# EAGLE design Display_Board_v3 (EAGLE 9.0.0)

## Sheet 1 of 3: Micro and CAN
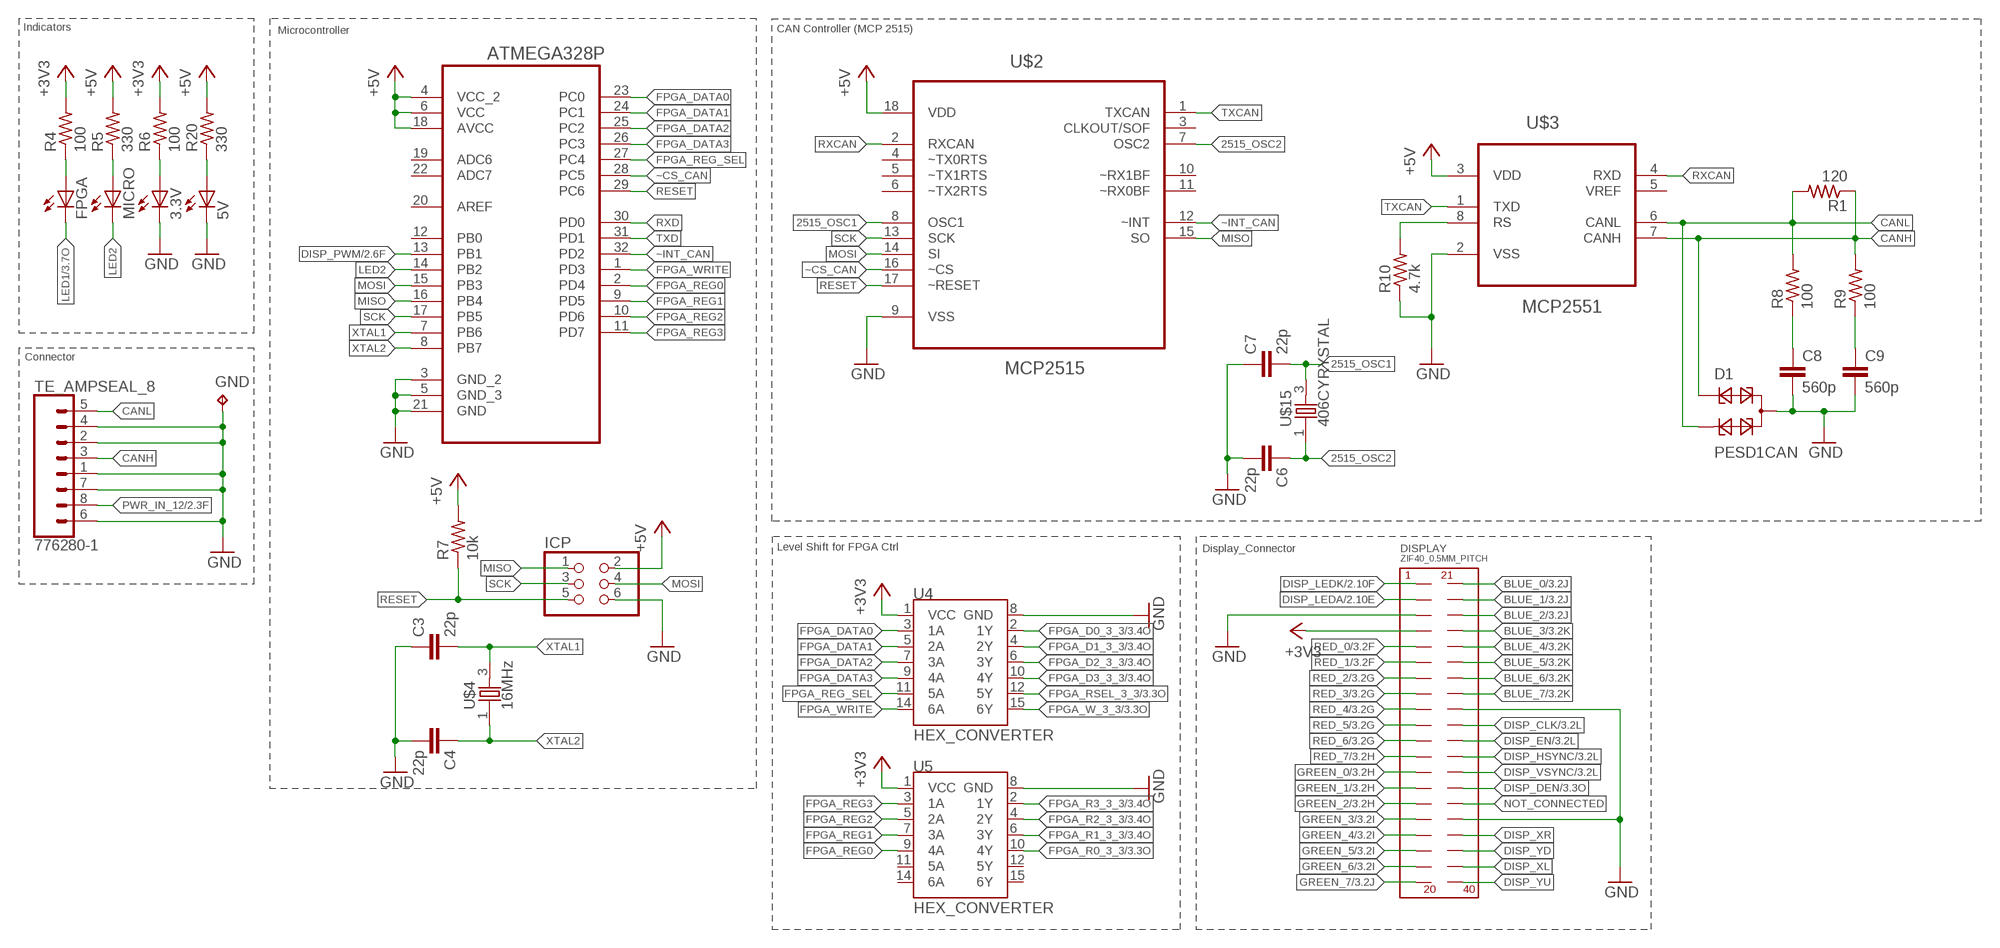
[diagram p0: schematic, sheet 1]

### Parts
3.3V  LEDCHIP-LED0805  [CHIP-LED0805]
5V  LEDCHIP-LED0805  [CHIP-LED0805]
ATMEGA328P  ATMEGA328P-AU  [QFP80P900X900X120-32N]
C3  22p  C-EUC0805K  [C0805K]
C4  22p  C-EUC0805K  [C0805K]
C6  22p  C-EUC0805K  [C0805K]
C7  22p  C-EUC0805K  [C0805K]
C8  560p  C-EUC0805K  [C0805K]
C9  560p  C-EUC0805K  [C0805K]
D1  PESD1CAN  [SOT23]
DISPLAY  ZIF40_0.5MM_PITCH  [ZIF40]
FPGA  LEDCHIP-LED0805  [CHIP-LED0805]
GND  TPTP12SQ  [TP12SQ]
ICP  PINHD-2X3  [2X03]
MICRO  LEDCHIP-LED0805  [CHIP-LED0805]
R1  120  R-US_R0805  [R0805]
R4  100  R-US_R0805  [R0805]
R5  330  R-US_R0805  [R0805]
R6  100  R-US_R0805  [R0805]
R7  10k  R-US_R0805  [R0805]
R8  100  R-US_R0805  [R0805]
R9  100  R-US_R0805  [R0805]
R10  4.7k  R-US_R0805  [R0805]
R20  330  R-US_R0805  [R0805]
TE_AMPSEAL_8  776280-1  [776280-1]
U4  HEX_CONVERTER  [SO016]
U5  HEX_CONVERTER  [SO016]
U$2  MCP2515  MCP2515-I/SO  [SOIC127P1034X264-18N]
U$3  MCP2551  MCP2551-I/SN  [SOIC127P600X175-8N]
U$4  16MHz  406CYRYSTAL  [CTS406]
U$15  406CYRYSTAL  [CTS406]

### Nets
2515_OSC1: C7.2 U$2.8(OSC1) U$15.3
2515_OSC2: C6.1 U$2.7(OSC2) U$15.1
+3V3: DISPLAY.P$4 R4.2 R6.2 U4.1(VCC) U5.1(VCC) ; also sheet 2,3
+5V: ATMEGA328P.4(VCC_2) ATMEGA328P.6(VCC) ATMEGA328P.18(AVCC) ICP.2 R5.2 R7.2 R20.2 U$2.18(VDD) U$3.3(VDD) ; also sheet 2
BLUE_0: DISPLAY.P$21 ; also sheet 3
BLUE_1: DISPLAY.P$22 ; also sheet 3
BLUE_2: DISPLAY.P$23 ; also sheet 3
BLUE_3: DISPLAY.P$24 ; also sheet 3
BLUE_4: DISPLAY.P$25 ; also sheet 3
BLUE_5: DISPLAY.P$26 ; also sheet 3
BLUE_6: DISPLAY.P$27 ; also sheet 3
BLUE_7: DISPLAY.P$28 ; also sheet 3
CANH: D1.1 R1.1 R9.2 TE_AMPSEAL_8.3 U$3.7(CANH)
CANL: D1.2 R1.2 R8.2 TE_AMPSEAL_8.5 U$3.6(CANL)
DISP_CLK: DISPLAY.P$30 ; also sheet 3
DISP_DEN: DISPLAY.P$34 ; also sheet 3
DISP_EN: DISPLAY.P$31 ; also sheet 3
DISP_HSYNC: DISPLAY.P$32 ; also sheet 3
DISP_LEDA: DISPLAY.P$2 ; also sheet 2
DISP_LEDK: DISPLAY.P$1 ; also sheet 2
DISP_PWM: ATMEGA328P.13(PB1) ; also sheet 2
DISP_VSYNC: DISPLAY.P$33 ; also sheet 3
DISP_XL: DISPLAY.P$39
DISP_XR: DISPLAY.P$37
DISP_YD: DISPLAY.P$38
DISP_YU: DISPLAY.P$40
FPGA_D0_3_3: U4.2(1Y) ; also sheet 3
FPGA_D1_3_3: U4.4(2Y) ; also sheet 3
FPGA_D2_3_3: U4.6(3Y) ; also sheet 3
FPGA_D3_3_3: U4.10(4Y) ; also sheet 3
FPGA_DATA0: ATMEGA328P.23(PC0) U4.3(1A)
FPGA_DATA1: ATMEGA328P.24(PC1) U4.5(2A)
FPGA_DATA2: ATMEGA328P.25(PC2) U4.7(3A)
FPGA_DATA3: ATMEGA328P.26(PC3) U4.9(4A)
FPGA_R0_3_3: U5.10(4Y) ; also sheet 3
FPGA_R1_3_3: U5.6(3Y) ; also sheet 3
FPGA_R2_3_3: U5.4(2Y) ; also sheet 3
FPGA_R3_3_3: U5.2(1Y) ; also sheet 3
FPGA_REG0: ATMEGA328P.2(PD4) U5.9(4A)
FPGA_REG1: ATMEGA328P.9(PD5) U5.7(3A)
FPGA_REG2: ATMEGA328P.10(PD6) U5.5(2A)
FPGA_REG3: ATMEGA328P.11(PD7) U5.3(1A)
FPGA_REG_SEL: ATMEGA328P.27(PC4) U4.11(5A)
FPGA_RSEL_3_3: U4.12(5Y) ; also sheet 3
FPGA_W_3_3: U4.15(6Y) ; also sheet 3
FPGA_WRITE: ATMEGA328P.1(PD3) U4.14(6A)
GND: 3.3V.C 5V.C ATMEGA328P.3(GND_2) ATMEGA328P.5(GND_3) ATMEGA328P.21(GND) C3.1 C4.2 C6.2 C7.1 C8.2 C9.2 D1.3 DISPLAY.P$3 DISPLAY.P$29 DISPLAY.P$36 GND.TP ICP.6 R10.1 TE_AMPSEAL_8.1 TE_AMPSEAL_8.2 TE_AMPSEAL_8.4 TE_AMPSEAL_8.6 TE_AMPSEAL_8.7 U4.8(GND) U5.8(GND) U$2.9(VSS) U$3.2(VSS) ; also sheet 2,3
GREEN_0: DISPLAY.P$13 ; also sheet 3
GREEN_1: DISPLAY.P$14 ; also sheet 3
GREEN_2: DISPLAY.P$15 ; also sheet 3
GREEN_3: DISPLAY.P$16 ; also sheet 3
GREEN_4: DISPLAY.P$17 ; also sheet 3
GREEN_5: DISPLAY.P$18 ; also sheet 3
GREEN_6: DISPLAY.P$19 ; also sheet 3
GREEN_7: DISPLAY.P$20 ; also sheet 3
LED1: FPGA.C ; also sheet 3
LED2: ATMEGA328P.14(PB2) MICRO.C
MISO: ATMEGA328P.16(PB4) ICP.1 U$2.15(SO)
MOSI: ATMEGA328P.15(PB3) ICP.4 U$2.14(SI)
N$2: FPGA.A R4.1
N$3: MICRO.A R5.1
N$4: 3.3V.A R6.1
N$5: R10.2 U$3.8(RS)
N$6: C8.1 R8.1
N$7: C9.1 R9.1
N$12: 5V.A R20.1
NOT_CONNECTED: DISPLAY.P$35
PWR_IN_12: TE_AMPSEAL_8.8 ; also sheet 2
RED_0: DISPLAY.P$5 ; also sheet 3
RED_1: DISPLAY.P$6 ; also sheet 3
RED_2: DISPLAY.P$7 ; also sheet 3
RED_3: DISPLAY.P$8 ; also sheet 3
RED_4: DISPLAY.P$9 ; also sheet 3
RED_5: DISPLAY.P$10 ; also sheet 3
RED_6: DISPLAY.P$11 ; also sheet 3
RED_7: DISPLAY.P$12 ; also sheet 3
RESET: ATMEGA328P.29(PC6) ICP.5 R7.1 U$2.17(~RESET)
RXCAN: U$2.2(RXCAN) U$3.4(RXD)
RXD: ATMEGA328P.30(PD0)
SCK: ATMEGA328P.17(PB5) ICP.3 U$2.13(SCK)
TXCAN: U$2.1(TXCAN) U$3.1(TXD)
TXD: ATMEGA328P.31(PD1)
XTAL1: ATMEGA328P.7(PB6) C3.2 U$4.3
XTAL2: ATMEGA328P.8(PB7) C4.1 U$4.1
~CS_CAN: ATMEGA328P.28(PC5) U$2.16(~CS)
~INT_CAN: ATMEGA328P.32(PD2) U$2.12(~INT)
Unconnected: ATMEGA328P.12(PB0) ATMEGA328P.19(ADC6) ATMEGA328P.20(AREF) ATMEGA328P.22(ADC7) U5.11(5A) U5.12(5Y) U5.14(6A) U5.15(6Y) U$2.3(CLKOUT/SOF) U$2.4(~TX0RTS) U$2.5(~TX1RTS) U$2.6(~TX2RTS) U$2.10(~RX1BF) U$2.11(~RX0BF) U$3.5(VREF)

### Notes on the sheet
- Indicators | Microcontroller | CAN Controller (MCP 2515)
- Connector
- Level Shift for FPGA Ctrl | Display_Connector

## Sheet 2 of 3: Power
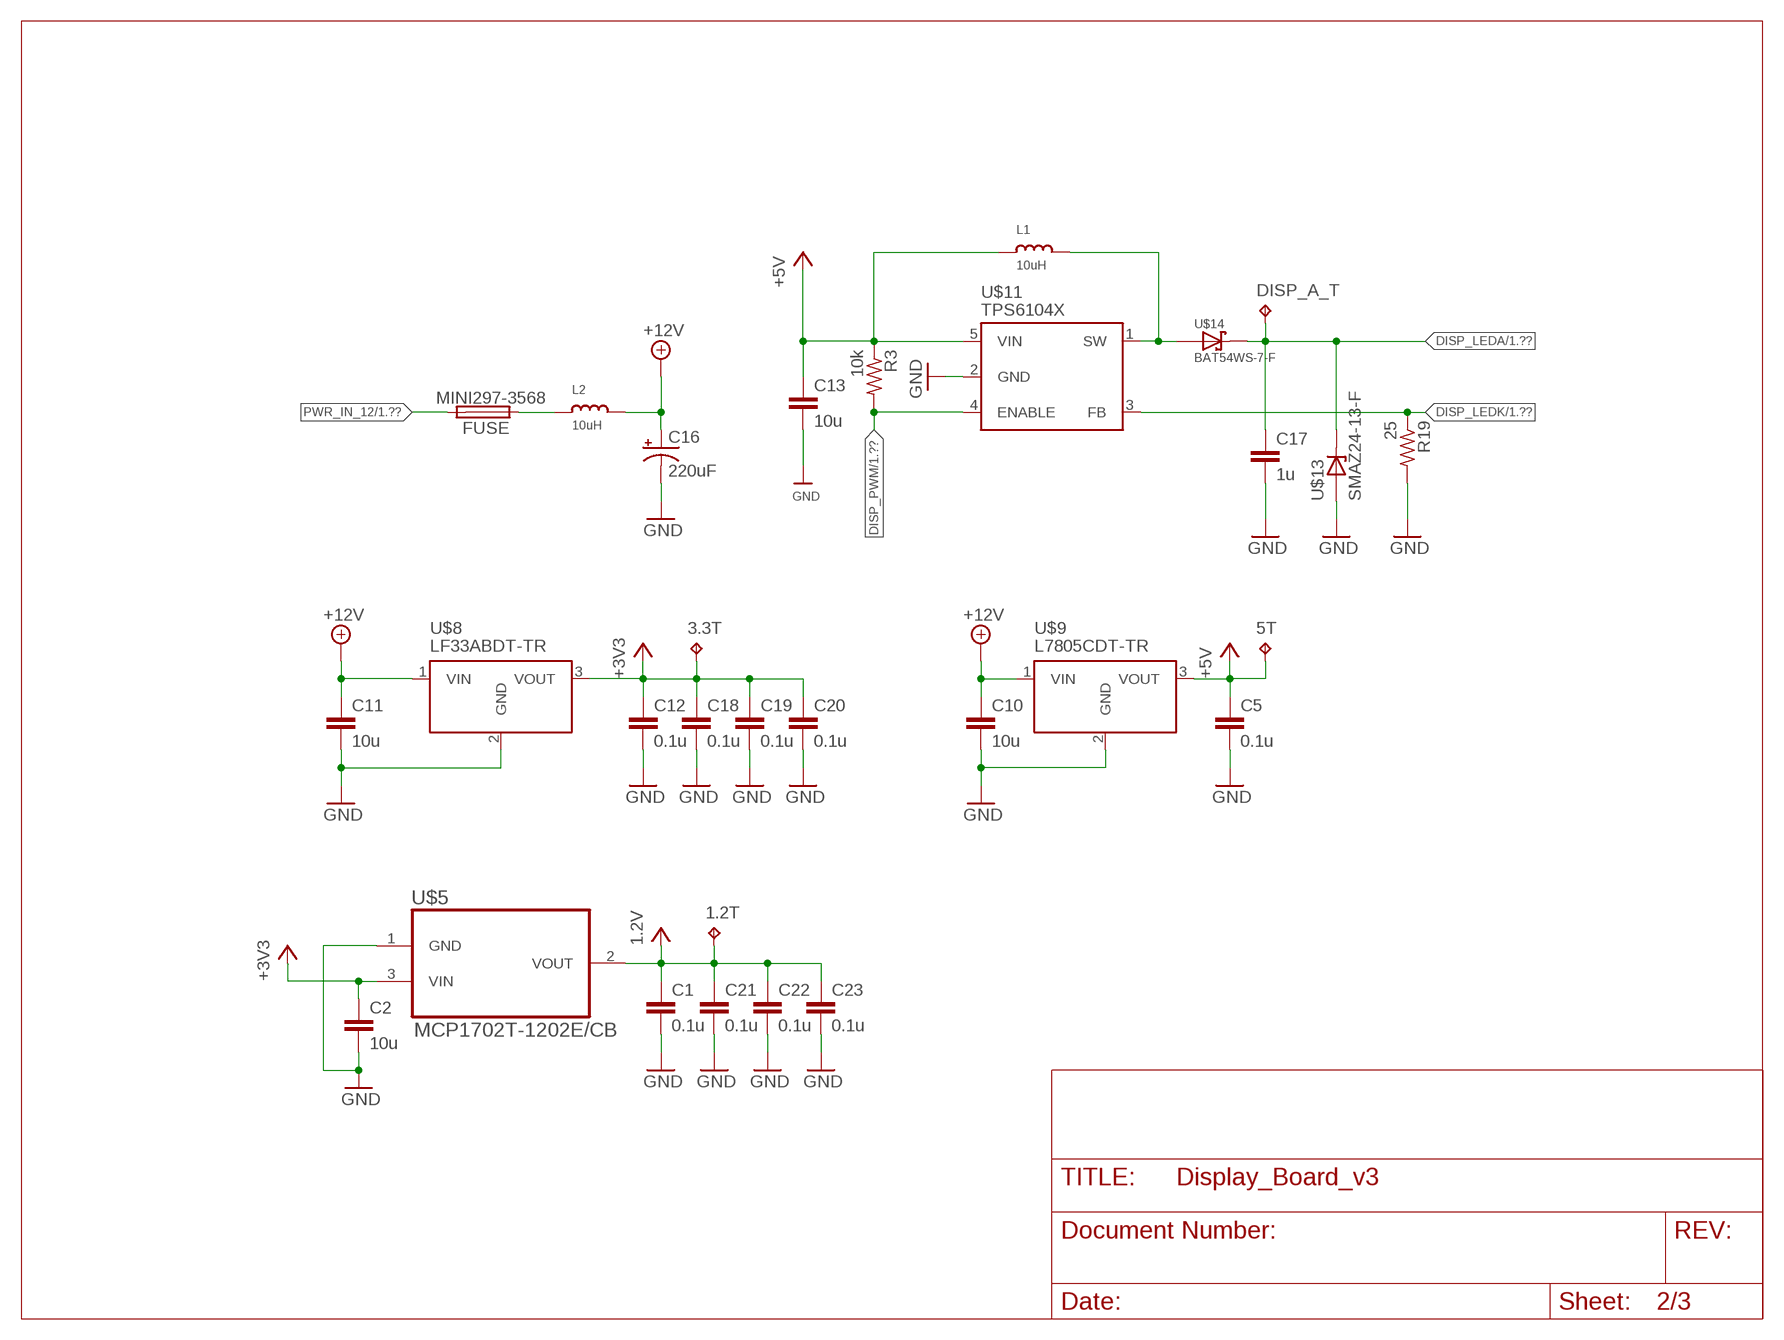
[diagram p1: schematic, sheet 2]

### Parts
1.2T  TPTP12SQ  [TP12SQ]
3.3T  TPTP12SQ  [TP12SQ]
5T  TPTP12SQ  [TP12SQ]
C1  0.1u  C-EUC0805K  [C0805K]
C2  10u  C-EUC0805K  [C0805K]
C5  0.1u  C-EUC0805K  [C0805K]
C10  10u  C-EUC0805K  [C0805K]
C11  10u  C-EUC0805K  [C0805K]
C12  0.1u  C-EUC0805K  [C0805K]
C13  10u  C-EUC0805K  [C0805K]
C16  220uF  CPOL-USUD-6,3X7,7  [UD-6,3X7,7_NICHICON]
C17  1u  C-EUC0805K  [C0805K]
C18  0.1u  C-EUC0805K  [C0805K]
C19  0.1u  C-EUC0805K  [C0805K]
C20  0.1u  C-EUC0805K  [C0805K]
C21  0.1u  C-EUC0805K  [C0805K]
C22  0.1u  C-EUC0805K  [C0805K]
C23  0.1u  C-EUC0805K  [C0805K]
DISP_A_T  TPTP12SQ  [TP12SQ]
FUSE  MINI297-3568  [3568]
L1  10uH  INDUCTORNR5040  [INDUCTOR_5X5MM_NR5040_NOTHERMALS]
L2  10uH  INDUCTORNR5040  [INDUCTOR_5X5MM_NR5040_NOTHERMALS]
R3  10k  R-US_R0805  [R0805]
R19  25  R-US_R0805  [R0805]
U$5  MCP1702T-1202E/CB  MCP1702T-1802E/CB  [SOT95P300X145-3N]
U$8  LF33ABDT-TR  [DPACK]
U$9  L7805CDT-TR  [DPACK]
U$11  TPS6104X  [SOT23-5L]
U$13  SMAZ24-13-F  [SMA_DIODE]
U$14  BAT54WS-7-F  [SOD323]

### Nets
+3V3: 3.3T.TP C2.1 C12.1 C18.1 C19.1 C20.1 U$5.3(VIN) U$8.3(VOUT) ; also sheet 1,3
+5V: 5T.TP C5.1 C13.1 L1.P$1 R3.1 U$9.3(VOUT) U$11.5(VIN) ; also sheet 1
+12V: C10.1 C11.1 C16.+ L2.P$2 U$8.1(VIN) U$9.1(VIN)
DISP_LEDA: C17.1 DISP_A_T.TP U$13.C U$14.1(C) ; also sheet 1
DISP_LEDK: R19.1 U$11.3(FB) ; also sheet 1
DISP_PWM: R3.2 U$11.4(ENABLE) ; also sheet 1
GND: C1.2 C2.2 C5.2 C10.2 C11.2 C12.2 C13.2 C16.- C17.2 C18.2 C19.2 C20.2 C21.2 C22.2 C23.2 R19.2 U$5.1(GND) U$8.2(GND) U$9.2(GND) U$11.2(GND) U$13.A ; also sheet 1,3
N$1: FUSE.P$1 FUSE.P$4 L2.P$1
N$8: L1.P$2 U$11.1(SW) U$14.2(A)
PWR_IN_12: FUSE.P$2 FUSE.P$3 ; also sheet 1
VCC: 1.2T.TP C1.1 C21.1 C22.1 C23.1 U$5.2(VOUT) ; supply symbol labelled 1.2V ; also sheet 3

## Sheet 3 of 3: Cyclone 2 FPGA
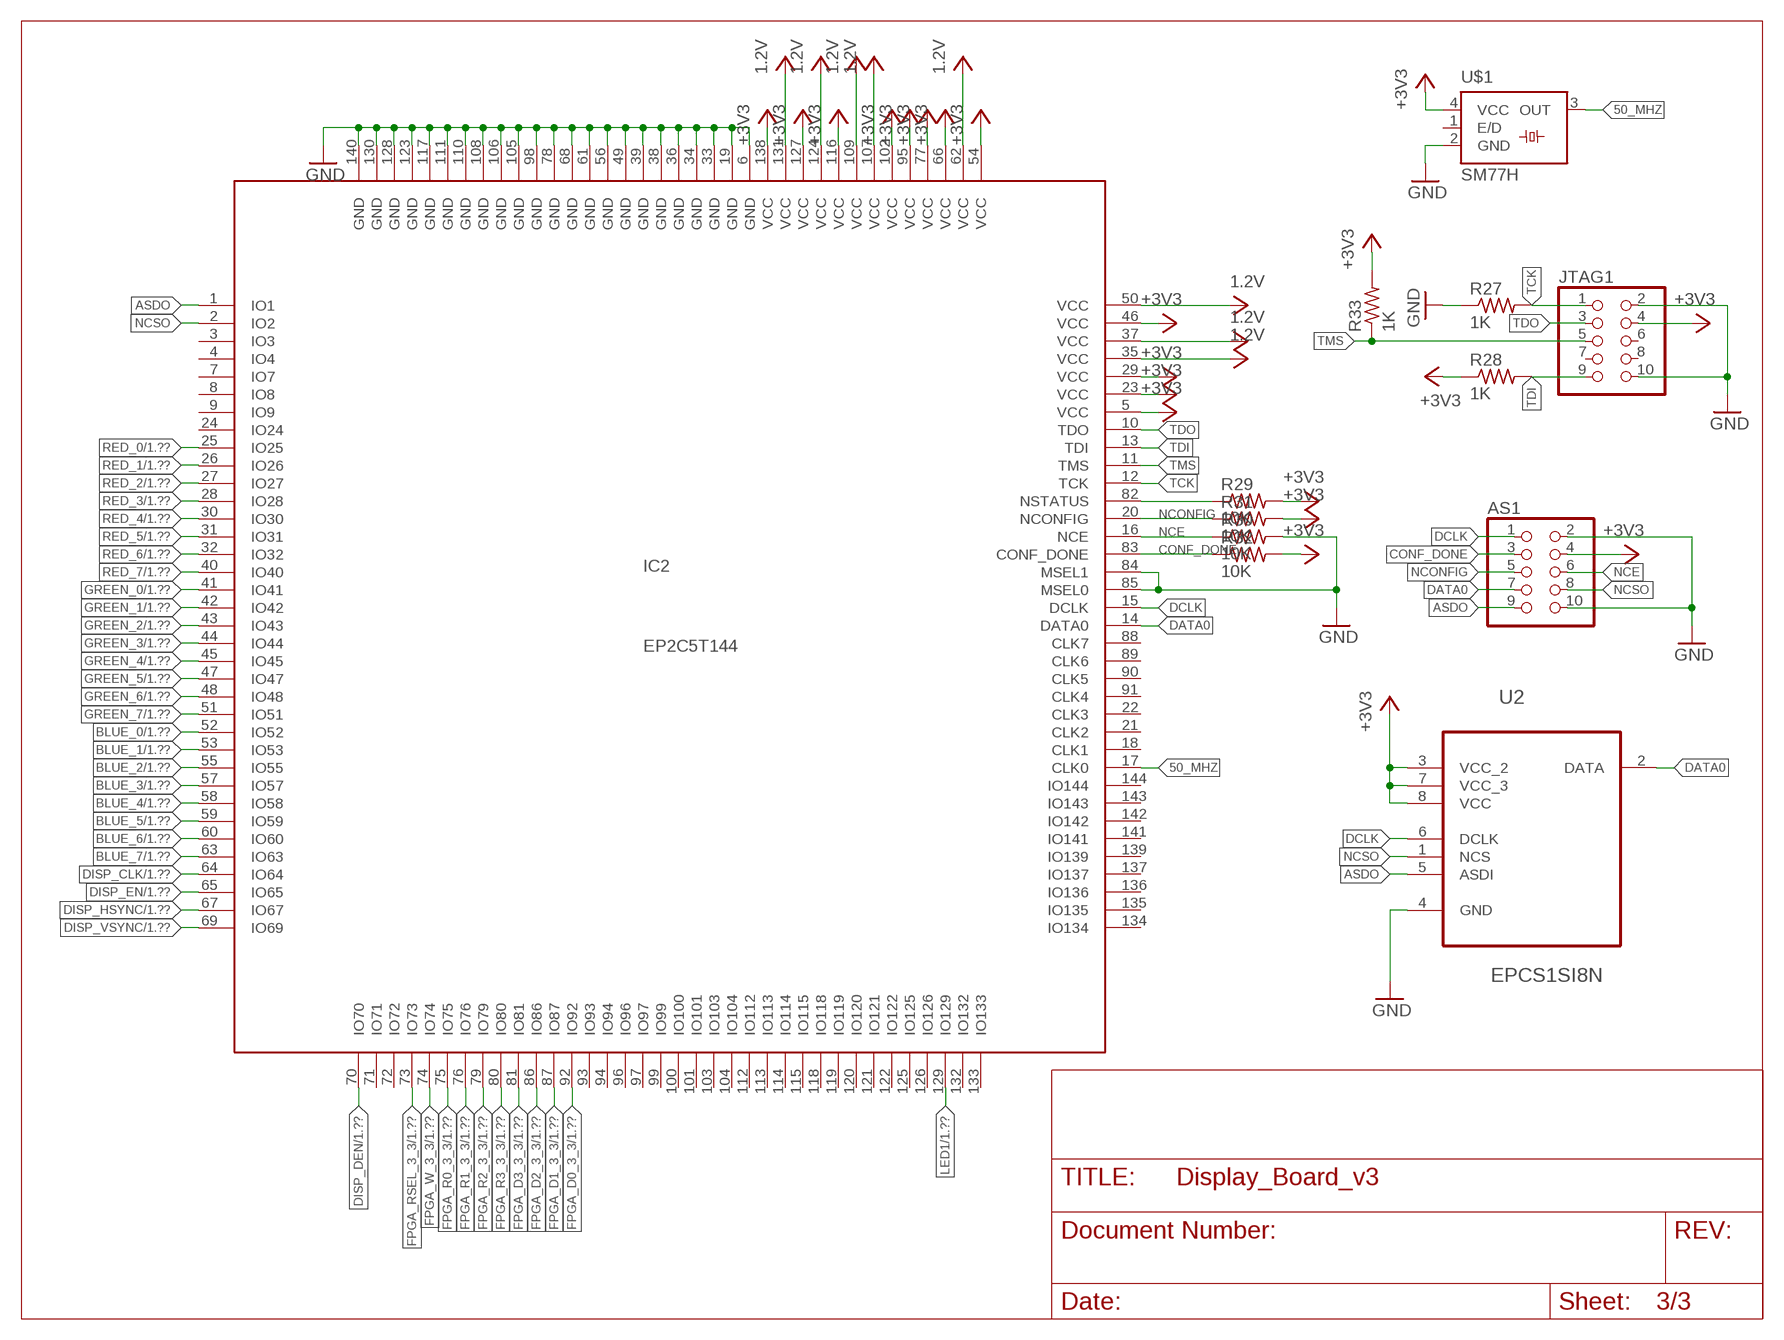
[diagram p2: schematic, sheet 3]

### Parts
AS1  PINHD-2X5  [2X05]
IC2  EP2C5T144  [TQFP144]
JTAG1  PINHD-2X5  [2X05]
R27  1K  R-US_R0805  [R0805]
R28  1K  R-US_R0805  [R0805]
R29  10K  R-US_R0805  [R0805]
R30  10K  R-US_R0805  [R0805]
R31  10K  R-US_R0805  [R0805]
R32  10K  R-US_R0805  [R0805]
R33  1K  R-US_R0805  [R0805]
U2  EPCS1SI8N  [SOIC127P600X175-8N]
U$1  SM77H  [SM77H]

### Nets
50_MHZ: IC2.17(CLK0) U$1.3(OUT)
+3V3: AS1.4 IC2.5(VCC) IC2.23(VCC) IC2.29(VCC) IC2.46(VCC) IC2.54(VCC) IC2.66(VCC) IC2.77(VCC) IC2.95(VCC) IC2.102(VCC) IC2.116(VCC) IC2.127(VCC) IC2.138(VCC) JTAG1.4 R28.1 R29.2 R31.2 R32.2 R33.2 U2.3(VCC_2) U2.7(VCC_3) U2.8(VCC) U$1.4(VCC) ; also sheet 1,2
ASDO: AS1.9 IC2.1(IO1) U2.5(ASDI)
BLUE_0: IC2.52(IO52) ; also sheet 1
BLUE_1: IC2.53(IO53) ; also sheet 1
BLUE_2: IC2.55(IO55) ; also sheet 1
BLUE_3: IC2.57(IO57) ; also sheet 1
BLUE_4: IC2.58(IO58) ; also sheet 1
BLUE_5: IC2.59(IO59) ; also sheet 1
BLUE_6: IC2.60(IO60) ; also sheet 1
BLUE_7: IC2.63(IO63) ; also sheet 1
CONF_DONE: AS1.3 IC2.83(CONF_DONE) R32.1
DATA0: AS1.7 IC2.14(DATA0) U2.2(DATA)
DCLK: AS1.1 IC2.15(DCLK) U2.6(DCLK)
DISP_CLK: IC2.64(IO64) ; also sheet 1
DISP_DEN: IC2.70(IO70) ; also sheet 1
DISP_EN: IC2.65(IO65) ; also sheet 1
DISP_HSYNC: IC2.67(IO67) ; also sheet 1
DISP_VSYNC: IC2.69(IO69) ; also sheet 1
FPGA_D0_3_3: IC2.92(IO92) ; also sheet 1
FPGA_D1_3_3: IC2.87(IO87) ; also sheet 1
FPGA_D2_3_3: IC2.86(IO86) ; also sheet 1
FPGA_D3_3_3: IC2.81(IO81) ; also sheet 1
FPGA_R0_3_3: IC2.75(IO75) ; also sheet 1
FPGA_R1_3_3: IC2.76(IO76) ; also sheet 1
FPGA_R2_3_3: IC2.79(IO79) ; also sheet 1
FPGA_R3_3_3: IC2.80(IO80) ; also sheet 1
FPGA_RSEL_3_3: IC2.73(IO73) ; also sheet 1
FPGA_W_3_3: IC2.74(IO74) ; also sheet 1
GND: AS1.2 AS1.10 IC2.6(GND) IC2.19(GND) IC2.33(GND) IC2.34(GND) IC2.36(GND) IC2.38(GND) IC2.39(GND) IC2.49(GND) IC2.56(GND) IC2.61(GND) IC2.68(GND) IC2.78(GND) IC2.84(MSEL1) IC2.85(MSEL0) IC2.98(GND) IC2.105(GND) IC2.106(GND) IC2.108(GND) IC2.110(GND) IC2.111(GND) IC2.117(GND) IC2.123(GND) IC2.128(GND) IC2.130(GND) IC2.140(GND) JTAG1.2 JTAG1.10 R27.1 R30.2 U2.4(GND) U$1.2(GND) ; also sheet 1,2
GREEN_0: IC2.41(IO41) ; also sheet 1
GREEN_1: IC2.42(IO42) ; also sheet 1
GREEN_2: IC2.43(IO43) ; also sheet 1
GREEN_3: IC2.44(IO44) ; also sheet 1
GREEN_4: IC2.45(IO45) ; also sheet 1
GREEN_5: IC2.47(IO47) ; also sheet 1
GREEN_6: IC2.48(IO48) ; also sheet 1
GREEN_7: IC2.51(IO51) ; also sheet 1
LED1: IC2.129(IO129) ; also sheet 1
N$21: IC2.82(NSTATUS) R29.1
NCE: AS1.6 IC2.16(NCE) R30.1
NCONFIG: AS1.5 IC2.20(NCONFIG) R31.1
NCSO: AS1.8 IC2.2(IO2) U2.1(NCS)
RED_0: IC2.25(IO25) ; also sheet 1
RED_1: IC2.26(IO26) ; also sheet 1
RED_2: IC2.27(IO27) ; also sheet 1
RED_3: IC2.28(IO28) ; also sheet 1
RED_4: IC2.30(IO30) ; also sheet 1
RED_5: IC2.31(IO31) ; also sheet 1
RED_6: IC2.32(IO32) ; also sheet 1
RED_7: IC2.40(IO40) ; also sheet 1
TCK: IC2.12(TCK) JTAG1.1 R27.2
TDI: IC2.13(TDI) JTAG1.9 R28.2
TDO: IC2.10(TDO) JTAG1.3
TMS: IC2.11(TMS) JTAG1.5 R33.1
VCC: IC2.35(VCC) IC2.37(VCC) IC2.50(VCC) IC2.62(VCC) IC2.107(VCC) IC2.109(VCC) IC2.124(VCC) IC2.131(VCC) ; supply symbol labelled 1.2V ; also sheet 2
Unconnected: IC2.3(IO3) IC2.4(IO4) IC2.7(IO7) IC2.8(IO8) IC2.9(IO9) IC2.18(CLK1) IC2.21(CLK2) IC2.22(CLK3) IC2.24(IO24) IC2.71(IO71) IC2.72(IO72) IC2.88(CLK7) IC2.89(CLK6) IC2.90(CLK5) IC2.91(CLK4) IC2.93(IO93) IC2.94(IO94) IC2.96(IO96) IC2.97(IO97) IC2.99(IO99) IC2.100(IO100) IC2.101(IO101) IC2.103(IO103) IC2.104(IO104) IC2.112(IO112) IC2.113(IO113) IC2.114(IO114) IC2.115(IO115) IC2.118(IO118) IC2.119(IO119) IC2.120(IO120) IC2.121(IO121) IC2.122(IO122) IC2.125(IO125) IC2.126(IO126) IC2.132(IO132) IC2.133(IO133) IC2.134(IO134) IC2.135(IO135) IC2.136(IO136) IC2.137(IO137) IC2.139(IO139) IC2.141(IO141) IC2.142(IO142) IC2.143(IO143) IC2.144(IO144) JTAG1.6 JTAG1.7 JTAG1.8 U$1.1(E/D)

## Library data of the parts
1.2T 3.3T 5T DISP_A_T GND = testpad:TP: Test pad
3.3V 5V FPGA MICRO = led:LED: LED OSRAM: - CHIPLED LG R971, LG N971, LY N971, LG Q971, LY Q971, LO R971, LY R971 LH N974, LH R974 LS Q976, LO Q976, LY Q976 LO Q996 - Hyper CHIPLED LW Q18S LB Q993, LB Q99A, LB R99A - SideLED LS A670, LO A670, LY A670, LG A670, LP A670 LB A673, LV A673, LT A673, LW A673 LH A674 LY A675 LS A676, LA A676, LO A676, LY A676, LW A676 LS A679, LY A679, LG A679 - Hyper Micro SIDELED® LS Y876, LA Y876, LO Y876, LY Y876 LT Y87S - SmartLED LW L88C, LW L88S LB L89C, LB L89S, LG L890 LS L89K, LO L89K, LY L89K LS L896, LA L896, LO L896, LY L896 - TOPLED LS T670, LO T670, LY T670, LG T670, LP T670 LSG T670, LSP T670, LSY T670, LOP T670, LYG T670 LG T671, LOG T671, LSG T671 LB T673, LV T673, LT T673, LW T673 LH T674 LS T676, LA T676, LO T676, LY T676, LB T676, LH T676, LSB T676, LW T676 LB T67C, LV T67C, LT T67C, LS T67K, LO T67K, LY T67K, LW E67C LS E67B, LA E67B, LO E67B, LY E67B, LB E67C, LV E67C, LT E67C LW T67C LS T679, LY T679, LG T679 LS T770, LO T770, LY T770, LG T770, LP T770 LB T773, LV T773, LT T773, LW T773 LH T774 LS E675, LA E675, LY E675, LS T675 LS T776, LA T776, LO T776, LY T776, LB T776 LHGB T686 LT T68C, LB T68C - Hyper Mini TOPLED® LB M676 - Mini TOPLED Santana® LG M470 LS M47K, LO M47K, LY M47K Source: http://www.osram.convergy.de LUXEON: - LUMILED® LXK2-PW12-R00, LXK2-PW12-S00, LXK2-PW14-U00, LXK2-PW14-V00 LXK2-PM12-R00, LXK2-PM12-S00, LXK2-PM14-U00 LXK2-PE12-Q00, LXK2-PE12-R00, LXK2-PE12-S00, LXK2-PE14-T00, LXK2-PE14-U00 LXK2-PB12-K00, LXK2-PB12-L00, LXK2-PB12-M00, LXK2-PB14-N00, LXK2-PB14-P00, LXK2-PB14-Q00 LXK2-PR12-L00, LXK2-PR12-M00, LXK2-PR14-Q00, LXK2-PR14-R00 LXK2-PD12-Q00, LXK2-PD12-R00, LXK2-PD12-S00 LXK2-PH12-R00, LXK2-PH12-S00 LXK2-PL12-P00, LXK2-PL12-Q00, LXK2-PL12-R00 Source: www.luxeon.com KINGBRIGHT: KA-3528ASYC Source: www.kingbright.com
AS1 JTAG1 = pinhead:PINHD-2X5: PIN HEADER
ATMEGA328P = Atmel_By_element14_Batch_1-00:ATMEGA328P-AU: 8-bit Microcontroller with In-System Programmable Flash; MPN: ATMEGA328P-AU; OC_FARNELL: 1715486; OC_NEWARK: 14R4631; PACKAGE: TQFP-32; SUPPLIER: Atmel
C1 C2 C5 C8-C13 C17-C23 = rcl:C-EU: CAPACITOR, European symbol
C3 C4 C6 C7 = resistor:C-EU: CAPACITOR, European symbol
C16 = rcl:CPOL-US: POLARIZED CAPACITOR, American symbol; SPICEPREFIX: C
D1 = diode:PESD1CAN: CAN bus ESD protection diode Source: http://www.nxp.com/documents/data_sheet/PESD1CAN.pdf
DISPLAY = Connectors:ZIF40_0.5MM_PITCH: 40 Pin 0.5mm ptch FPC Connector http://www.buydisplay.com/default/40-pin-0-5mm-pitch-top-contact-zif-connector-fpc-connector
FUSE = Fuse:MINI297-3568
IC2 = altera-cyclone-II:EP2C5T144: EP2C5T144 Auto generated by make-symbol-device-package-bsdl.ulp Rev. 19 Tip: Use split-device-symbol.ulp to generate a Device with multiple small symbols! Read HELP. Source: EP2C5T144.BSD; MPN: EP2C5T144C8N; OC_FARNELL: 1453495; OC_NEWARK: 51R0568
ICP = pinhead:PINHD-2X3: PIN HEADER
L1 L2 = microbuilder:INDUCTOR: Inductors 0603: 10nH Ceramic Inductor - microwire antenna/RF (Digikey: 712-1434-2-ND) 0805: 560nH Ceramic Inductor - RF (Digikey: 553-1047-1-ND) 270nH Ceramic Inductor - Q = 40@250MHz, +-5%, 1 Ohm DC Resistance (Digikey: 535-10506-2-ND) 1007 (2518 Metric) SMT: 10µH 10% 250mOhm 820mA 1007 Inductor (Digikey: 587-2189-1-ND) 22µH 10% 500mOhm 580mA 1007 Inductor (Digikey: 587-2190-1-ND) 47µH 10% 950mOhm 420mA 1007 Inductor (Digikey: 587-2191-1-ND) 47µH 5% 100mOhm 1A 1008 Inductor (Digikey: 732-1816-1-ND) 5.0x5.0mm (Taiyo Yuden NR5040 Series) 6.8µH 20% 2.3A 64mOhm Inductor (Digikey: 587-2374-2-ND) 5.0x5.0mm (TDK VLC5045 Series) 4.7µH 20% 3.3A 34mOhm Inductor (Digikey: 445-6526-1-ND) 6.8µH 20% 2.7A 46mOhm Inductor (Digikey: 445-6527-1-ND) 6.0x6.0mm (TDK VLC6045 Series) 4.7µH 20% 3.8A 27mOhm Inductor (Digikey: 445-6538-2-ND) 6.8µH 20% 3A 41mOhm Inductor (Digikey: 445-6540-1-ND) 6.2µH 30% 2.2A 45mOhm Inductor (Digikey: SRR5028-6R2YCT-ND) - Not TDK VLC6045 but footprint should match 6.0x6.0mm (TDK SLF6045 Series) 6.8uH 30% 2A 33mOhm Inductor (Digikey: 445-4572-1-ND, Mouser: 810-SLF645T6R8N2R0PF) 6.0x6.0mm (Sumida CDRH5D28 Series) 6.2uH 30% 1.8A 45mOhm Inductor (Digikey: 308-1542-1-ND) Taiyo Yuden NR3015T2R2M - 2.2uH 20% 1.5A (Digikey: 587-1648-2-ND, Mouser: 963-NR3015T2R2M) - Used with TI TPS62172 CoilCraft RFID Transponder Coil - MA5532-AE (For use with AS3935 Lightning Sensor)
R1 R7-R10 = rcl:R-US_: RESISTOR, American symbol
R3 R19 = rcl:R-US_: RESISTOR, American symbol; SPICEPREFIX: R
R4-R6 R20 R27-R33 = resistor:R-US_: RESISTOR, American symbol
TE_AMPSEAL_8 = IFE_AMPSEAL_Conn:776280-1: AMPSEAL 8pin Connector Ampseal 8-pin connector Model: 776280-1
U2 = Altera_By_element14_Batch_1:EPCS1SI8N: Serial Configuration Devices; DESCRIPTION: Serial Configuration Devices; MPN: EPCS1SI8N; OC_FARNELL: 1453504; OC_NEWARK: 51R0466; PACKAGE: SOIC-8; SUPPLIER: ALTERA
U4 U5 = SparkFun-DigitalIC:HEX_CONVERTER: 74HC4050 Hex Buffer Level Shifter SMD SO016; PROD_ID: IC-09604
U$1 = Display_Custom:SM77H: SM77H Crystal Oscillator http://www.abracon.com/Oscillators/ASV.pdf
U$2 = Microchip_By_element14_Batch_1:MCP2515-I/SO: CAN Controller; MPN: MCP2515-I/SO; OC_FARNELL: 1292239; OC_NEWARK: 29H7136; PACKAGE: SOIC-18; SUPPLIER: Microchip
U$3 = Microchip_By_element14_Batch_1:MCP2551-I/SN: High-Speed CAN Transceiver; MPN: MCP2551-I/SN; OC_FARNELL: 9758569; OC_NEWARK: 69K7604; PACKAGE: SOIC-8; SUPPLIER: Microchip
U$4 U$15 = Display_Custom:406CYRYSTAL: Crystal Oscillator in 406 SMT Package https://www.ctscorp.com/wp-content/uploads/406.pdf
U$5 = Microchip_By_element14_Batch_1:MCP1702T-1802E/CB: Low Quiescent Current LDO Regulator; DESCRIPTION: LDO VOLT REG; MPN: MCP1702T-1802E/CB; OC_FARNELL: 1331488; OC_NEWARK: 84R5177; PACKAGE: SOT-3; SUPPLIER: Microchip
U$8 = Display_Custom:LF33ABDT-TR: ST - LFxx LF33ABDT-TR 3.3V 500mA linear regulator
U$9 = Display_Custom:L7805CDT-TR: ST - L78 L7805CDT-TR 5V 1.5A Linear Regulator
U$11 = Display_Custom:TPS6104X: Texas Insturments TPS6104x Low-Power DC-DC Boost Converter in SOT-23 http://www.ti.com/lit/ds/symlink/tps61041.pdf
U$13 = Display_Custom:SMAZ24-13-F: Diodes Inc 24V Zener Diode 24V 1W zener diode is SMA package http://www.ti.com/lit/ds/symlink/tps61041.pdf
U$14 = Display_Custom:BAT54WS-7-F: Diodes Incorporated BAT54WS-7-F Small Form Factor 30V 100mA Schottkey Diode https://www.diodes.com/assets/Datasheets/ds30098.pdf

## Net classes
0 default: width 0.305 mm

## Board
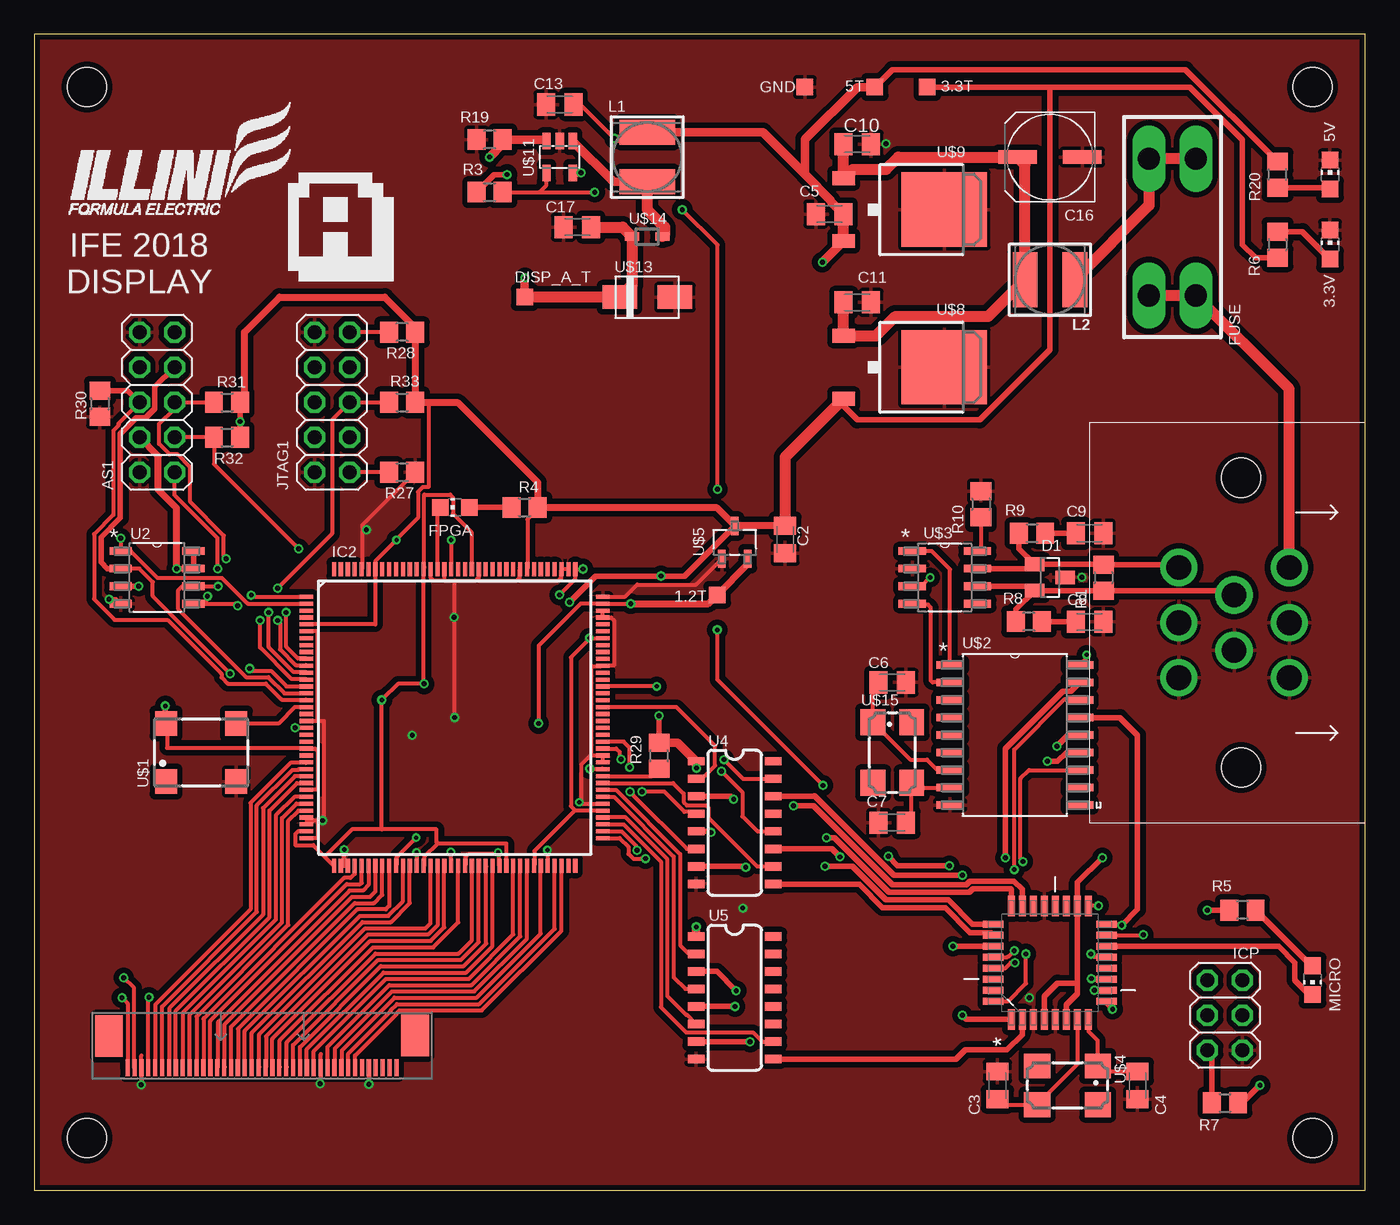
[diagram p3: board, top side]
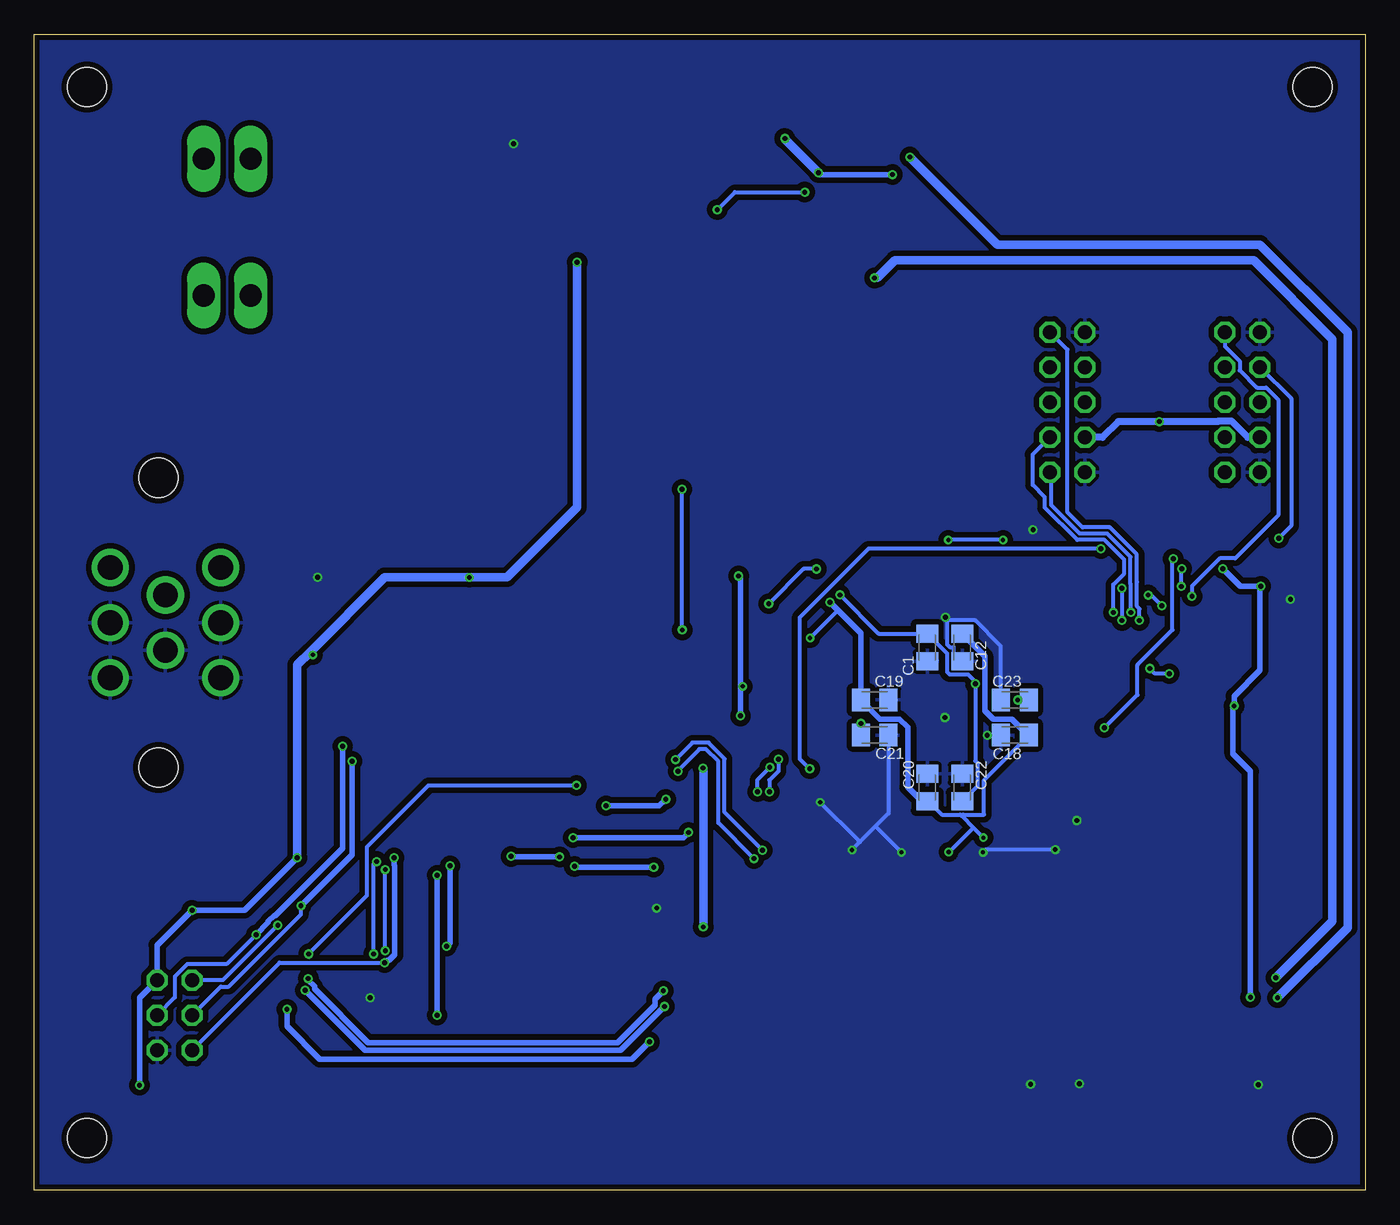
[diagram p4: board, bottom side, seen from below]

Size 96.52 x 83.82 mm. Coordinates in mm from the lower left corner, seen from the top.
Outline: 0,0 96.52,0 96.52,83.82 0,83.82 0,0
Copper layers (1*16): Top 0.035mm / dielectric 1.5mm / Bottom 0.035mm
Design rules "SeeedStudio_2layer_DRU_no_angle_20140221": minimum track width 6mil, minimum drill 12mil, track to track 6mil, track to pad 6mil, pad to pad 6mil, via to via 6mil, smd to smd 0mil, copper to edge 10mil, drill to drill 10mil, minimum pad ring 10mil, minimum via ring 6mil, stop-mask expansion 2mil, vias tented up to drill 100mil, thermal gap 10mil
Holes 2.84 mm at 3.81,3.81 92.71,3.81 92.71,80.01 3.81,80.01

### Footprints (pad centres in the part's own frame; a part is rotated, then mirrored left to right if it is on the bottom)
TP12SQ = smd 1.2 x 1.2: TP 0,0
CHIP-LED0805 = smd 1.2 x 1.2: A 0,-1.05; C 0,1.05
2X05 = drill 1.016 octagon: 1 -5.08,-1.27; 2 -5.08,1.27; 3 -2.54,-1.27; 4 -2.54,1.27; 5 0,-1.27; 6 0,1.27; 7 2.54,-1.27; 8 2.54,1.27; 9 5.08,-1.27; 10 5.08,1.27
QFP80P900X900X120-32N = smd 1.473 x 0.508: 1 -4.115,2.794; 2 -4.115,2.007; 3 -4.115,1.194; 4 -4.115,0.406; 5 -4.115,-0.406; 6 -4.115,-1.194; 7 -4.115,-2.007; 8 -4.115,-2.794; 17 4.115,-2.794; 18 4.115,-2.007; 19 4.115,-1.194; 20 4.115,-0.406; 21 4.115,0.406; 22 4.115,1.194; 23 4.115,2.007; 24 4.115,2.794 | smd 0.508 x 1.473: 9 -2.794,-4.115; 10 -2.007,-4.115; 11 -1.194,-4.115; 12 -0.406,-4.115; 13 0.406,-4.115; 14 1.194,-4.115; 15 2.007,-4.115; 16 2.794,-4.115; 25 2.794,4.115; 26 2.007,4.115; 27 1.194,4.115; 28 0.406,4.115; 29 -0.406,4.115; 30 -1.194,4.115; 31 -2.007,4.115; 32 -2.794,4.115
C0805K = smd 1.3 x 1.6: 1 -1,0; 2 1,0
UD-6,3X7,7_NICHICON = smd 2.8 x 1: + 2.35,0; - -2.35,0
SOT23 = smd 1 x 1.4: 1 -0.95,-1.1; 2 0.95,-1.1; 3 0,1.1
ZIF40 = smd 0.3 x 1.25: P$1 -9.75,0; P$2 -9.25,0; P$3 -8.75,0; P$4 -8.25,0; P$5 -7.75,0; P$6 -7.25,0; P$7 -6.75,0; P$8 -6.25,0; P$9 -5.75,0; P$10 -5.25,0; P$11 -4.75,0; P$12 -4.25,0; P$13 -3.75,0; P$14 -3.25,0; P$15 -2.75,0; P$16 -2.25,0; P$17 -1.75,0; P$18 -1.25,0; P$19 -0.75,0; P$20 -0.25,0; P$21 0.25,0; P$22 0.75,0; P$23 1.25,0; P$24 1.75,0; P$25 2.25,0; P$26 2.75,0; P$27 3.25,0; P$28 3.75,0; P$29 4.25,0; P$30 4.75,0; P$31 5.25,0; P$32 5.75,0; P$33 6.25,0; P$34 6.75,0; P$35 7.25,0; P$36 7.75,0; P$37 8.25,0; P$38 8.75,0; P$39 9.25,0; P$40 9.75,0 | smd 2 x 3: P$41 -11.1,2.3; P$42 11.1,2.35
3568 = drill 1.6 long: P$1 -4.96,1.7; P$2 4.96,1.7; P$3 4.96,-1.7; P$4 -4.96,-1.7
TQFP144 = smd 1 x 0.3: 1 -10.75,8.75; 2 -10.75,8.25; 3 -10.75,7.75; 4 -10.75,7.25; 5 -10.75,6.75; 6 -10.75,6.25; 7 -10.75,5.75; 8 -10.75,5.25; 9 -10.75,4.75; 10 -10.75,4.25; 11 -10.75,3.75; 12 -10.75,3.25; 13 -10.75,2.75; 14 -10.75,2.25; 15 -10.75,1.75; 16 -10.75,1.25; 17 -10.75,0.75; 18 -10.75,0.25; 19 -10.75,-0.25; 20 -10.75,-0.75; 21 -10.75,-1.25; 22 -10.75,-1.75; 23 -10.75,-2.25; 24 -10.75,-2.75; 25 -10.75,-3.25; 26 -10.75,-3.75; 27 -10.75,-4.25; 28 -10.75,-4.75; 29 -10.75,-5.25; 30 -10.75,-5.75; 31 -10.75,-6.25; 32 -10.75,-6.75; 33 -10.75,-7.25; 34 -10.75,-7.75; 35 -10.75,-8.25; 36 -10.75,-8.75; 73 10.75,-8.75; 74 10.75,-8.25; 75 10.75,-7.75; 76 10.75,-7.25; 77 10.75,-6.75; 78 10.75,-6.25; 79 10.75,-5.75; 80 10.75,-5.25; 81 10.75,-4.75; 82 10.75,-4.25; 83 10.75,-3.75; 84 10.75,-3.25; 85 10.75,-2.75; 86 10.75,-2.25; 87 10.75,-1.75; 88 10.75,-1.25; 89 10.75,-0.75; 90 10.75,-0.25; 91 10.75,0.25; 92 10.75,0.75; 93 10.75,1.25; 94 10.75,1.75; 95 10.75,2.25; 96 10.75,2.75; 97 10.75,3.25; 98 10.75,3.75; 99 10.75,4.25; 100 10.75,4.75; 101 10.75,5.25; 102 10.75,5.75; 103 10.75,6.25; 104 10.75,6.75; 105 10.75,7.25; 106 10.75,7.75; 107 10.75,8.25; 108 10.75,8.75 | smd 0.3 x 1: 37 -8.75,-10.75; 38 -8.25,-10.75; 39 -7.75,-10.75; 40 -7.25,-10.75; 41 -6.75,-10.75; 42 -6.25,-10.75; 43 -5.75,-10.75; 44 -5.25,-10.75; 45 -4.75,-10.75; 46 -4.25,-10.75; 47 -3.75,-10.75; 48 -3.25,-10.75; 49 -2.75,-10.75; 50 -2.25,-10.75; 51 -1.75,-10.75; 52 -1.25,-10.75; 53 -0.75,-10.75; 54 -0.25,-10.75; 55 0.25,-10.75; 56 0.75,-10.75; 57 1.25,-10.75; 58 1.75,-10.75; 59 2.25,-10.75; 60 2.75,-10.75; 61 3.25,-10.75; 62 3.75,-10.75; 63 4.25,-10.75; 64 4.75,-10.75; 65 5.25,-10.75; 66 5.75,-10.75; 67 6.25,-10.75; 68 6.75,-10.75; 69 7.25,-10.75; 70 7.75,-10.75; 71 8.25,-10.75; 72 8.75,-10.75; 109 8.75,10.75; 110 8.25,10.75; 111 7.75,10.75; 112 7.25,10.75; 113 6.75,10.75; 114 6.25,10.75; 115 5.75,10.75; 116 5.25,10.75; 117 4.75,10.75; 118 4.25,10.75; 119 3.75,10.75; 120 3.25,10.75; 121 2.75,10.75; 122 2.25,10.75; 123 1.75,10.75; 124 1.25,10.75; 125 0.75,10.75; 126 0.25,10.75; 127 -0.25,10.75; 128 -0.75,10.75; 129 -1.25,10.75; 130 -1.75,10.75; 131 -2.25,10.75; 132 -2.75,10.75; 133 -3.25,10.75; 134 -3.75,10.75; 135 -4.25,10.75; 136 -4.75,10.75; 137 -5.25,10.75; 138 -5.75,10.75; 139 -6.25,10.75; 140 -6.75,10.75; 141 -7.25,10.75; 142 -7.75,10.75; 143 -8.25,10.75; 144 -8.75,10.75
2X03 = drill 1.016 octagon: 1 -2.54,-1.27; 2 -2.54,1.27; 3 0,-1.27; 4 0,1.27; 5 2.54,-1.27; 6 2.54,1.27
INDUCTOR_5X5MM_NR5040_NOTHERMALS = smd 1.8 x 4: P$1 -1.8,0; P$2 1.8,0
R0805 = smd 1.3 x 1.5: 1 -0.95,0; 2 0.95,0
776280-1 = drill 1.8: 1 10.5,13.5; 2 14.5,13.5; 3 18.5,13.5; 4 12.5,9.5; 5 16.5,9.5; 6 10.5,5.5; 7 14.5,5.5; 8 18.5,5.5 | hole 2.85: 4,9; 25,9
SOIC127P600X175-8N = smd 1.6 x 0.559: 1 -2.642,1.905; 2 -2.642,0.635; 3 -2.642,-0.635; 4 -2.642,-1.905; 5 2.642,-1.905; 6 2.642,-0.635; 7 2.642,0.635; 8 2.642,1.905
SO016 = smd 0.6 x 1.2: 1 -4.445,-2.8; 2 -3.175,-2.8; 3 -1.905,-2.8; 4 -0.635,-2.8; 5 0.635,-2.8; 6 1.905,-2.8; 7 3.175,-2.8; 8 4.445,-2.8; 9 4.445,2.8; 10 3.175,2.8; 11 1.905,2.8; 12 0.635,2.8; 13 -0.635,2.8; 14 -1.905,2.8; 15 -3.175,2.8; 16 -4.445,2.8
SM77H = smd 1.6 x 1.8: 1 -2.55,-2.1; 2 2.55,-2.1; 3 2.55,2.1; 4 -2.55,2.1
SOIC127P1034X264-18N = smd 1.981 x 0.559: 1 -4.699,5.08; 2 -4.699,3.81; 3 -4.699,2.54; 4 -4.699,1.27; 5 -4.699,0; 6 -4.699,-1.27; 7 -4.699,-2.54; 8 -4.699,-3.81; 9 -4.699,-5.08; 10 4.699,-5.08; 11 4.699,-3.81; 12 4.699,-2.54; 13 4.699,-1.27; 14 4.699,0; 15 4.699,1.27; 16 4.699,2.54; 17 4.699,3.81; 18 4.699,5.08
SOIC127P600X175-8N' = smd 1.981 x 0.559: 1 -2.362,1.905; 2 -2.362,0.635; 3 -2.362,-0.635; 4 -2.362,-1.905; 5 2.362,-1.905; 6 2.362,-0.635; 7 2.362,0.635; 8 2.362,1.905
CTS406 = smd 1.9 x 1.8: 1 -2.2,-1.4; 2 2.2,-1.4; 3 2.2,1.4; 4 -2.2,1.4
SOT95P300X145-3N = smd 0.559 x 1.321: 1 -0.94,-1.194; 2 0.94,-1.194; 3 0,1.194
DPACK = smd 1 x 1.6: 1 -2.28,-4.8; 3 2.28,-4.8 | smd 5.4 x 6.2: 2 0,2.5
SOT23-5L = smd 0.6 x 1.2: 1 -0.95,-1.15; 2 0,-1.15; 3 0.95,-1.15; 4 0.95,1.15; 5 -0.95,1.15
SMA_DIODE = smd 2.5 x 1.7: A 2,0; C -2,0
SOD323 = smd 1 x 0.6: 1 -1.1,0; 2 1.1,0

### Placement (x,y rotation side)
1.2T  49.53,43.18 0 top
3.3T  64.77,80.01 0 top
3.3V  93.98,68.58 0 top
5T  60.96,80.01 0 top
5V  93.98,73.66 0 top
AS1  8.89,57.15 90 top
ATMEGA328P  73.66,16.51 90 top
C1  31.75,39.37 270 bottom
C2  54.46,47.19 270 top
C3  69.85,7.62 270 top
C4  80.01,7.62 270 top
C5  57.68,70.79 180 top
C6  62.23,36.83 0 top
C7  62.23,26.67 0 top
C8  76.53,41.22 0 top
C9  76.53,47.65 0 top
C10  59.69,75.87 0 top
C11  59.69,64.39 0 top
C12  29.21,39.37 270 bottom
C13  38.1,78.74 180 top
C16  73.66,74.93 180 top
C17  39.37,69.85 180 top
C18  25.4,33.02 180 bottom
C19  35.56,35.56 0 bottom
C20  31.75,29.21 90 bottom
C21  35.56,33.02 0 bottom
C22  29.21,29.21 90 bottom
C23  25.4,35.56 180 bottom
D1  73.66,44.45 270 top
DISP_A_T  35.56,64.77 0 top
DISPLAY  16.51,8.89 0 top
FPGA  30.48,49.53 90 top
FUSE  82.55,69.85 270 top
GND  55.88,80.01 0 top
IC2  30.48,34.29 0 top
ICP  86.36,12.7 270 top
JTAG1  21.59,57.15 90 top
L1  44.45,74.93 270 top
L2  73.66,66.04 180 top
MICRO  92.71,15.24 180 top
R1  77.55,44.42 270 top
R3  33.02,72.39 0 top
R4  35.56,49.53 0 top
R5  87.63,20.32 180 top
R6  90.17,68.58 270 top
R7  86.36,6.35 0 top
R8  72.14,41.25 180 top
R9  72.36,47.65 180 top
R10  68.66,49.76 270 top
R19  33.02,76.2 180 top
R20  90.17,73.66 90 top
R27  26.67,52.07 180 top
R28  26.67,62.23 180 top
R29  45.31,31.52 90 top
R30  4.75,57.05 270 top
R31  13.97,57.15 0 top
R32  13.97,54.61 0 top
R33  26.67,57.15 0 top
TE_AMPSEAL_8  96.52,26.67 90 top
U2  8.89,44.45 0 top
U4  50.8,26.67 270 top
U5  50.8,13.97 270 top
U$1  12.09,31.75 0 top
U$2  71.12,33.02 0 top
U$3  MCP2551  [SOIC127P600X175-8N']  66.04,44.45 0 top
U$4  74.93,7.62 180 top
U$5  50.8,46.99 0 top
U$8  63.5,59.69 270 top
U$9  63.5,71.12 270 top
U$11  38.1,74.93 180 top
U$13  44.45,64.77 0 top
U$14  44.45,69.16 0 top
U$15  62.23,31.75 270 top

### Tracks (layer width: path | path; a pad name or v marks a point on that pad's centre or on a via)
50_MHZ
  Top 0.305: IC2.17 18.89,35.04 17.7,33.85 U$1.3
2515_OSC1
  Top 0.305: C7.2 63.63,27.07 U$15.3 63.97,29.21 U$2.8
2515_OSC2
  Top 0.305: C6.1 60.83,36.43 U$15.1 63.54,31.24 64.75,31.24 65.51,30.48 U$2.7
+3V3  (via drill 0.3, 0.35)
  Top 0.305: DISPLAY.P$4 8.26,13.95 v8.31,13.99 | IC2.5 24.71,41.05 24.71,45.03 IC2.138 24.77,45.19 24.77,45.67 v26.26,47.17 26.34,47.3 27.81,48.77 27.81,50.65 28.17,51 28.57,51 28.57,57.15 | v30.23,47.17 30.23,45.06 IC2.127 | IC2.29 19.74,29.06 20.55,29.06 20.55,31.83 20.34,32.03 IC2.23 19.58,32.08 9.63,32.08 9.63,33.66 U$1.4 | 39.19,27.53 36.27,24.61 36.27,23.57 36.25,23.55 IC2.66 | 39.19,27.53 IC2.77 | v27.69,25.58 26.26,24.16 26.26,23.57 IC2.46 | v30.2,24.54 30.2,23.57 IC2.54 | v45.14,36.55 41.25,36.55 IC2.95 | IC2.102 41.22,40.06 v40.26,40.06 40.18,39.93 38.91,38.66 38.91,27.86 39.12,27.66 39.19,27.53 | IC2.116 35.74,45.06 35.76,45.09 35.76,48.67 36.4,49.3 R4.2 | 27.71,62.46 R28.1
  Top 0.406: U2.3 v7.57,43.81 | v10.31,45.09 U2.7 U2.8 | 3.3T.TP 73.66,80.01 | 73.66,80.01 83.82,80.01 87.63,76.2 87.63,68.58 88.58,67.63 R6.2 | R31.2 v14.92,55.75 R32.2 | v9.5,35.13 9.5,33.89 U$1.4 | 58.43,57.14 59.69,55.88 68.58,55.88 73.66,60.96 73.66,80.01 | U$5.3 47.17,44.55 v45.44,44.55 40.72,44.55 v38.81,42.65 | R29.2 v45.31,34.41
  Top 0.508: C2.1 50.81,48.19 | 50.81,48.19 U$5.3 | v10.31,45.09 10.31,49.48 8.99,50.8 8.99,53.24 AS1.4 | R28.1 R33.2 28.57,57.15 30.68,57.15 36.5,51.33 R4.2 49.47,49.53 50.81,48.19 | R31.2 15.24,57.47 15.24,62.23 17.78,64.77 25.4,64.77 27.71,62.46 27.94,62.23
  Top 0.61: R29.2 46.64,32.47 U4.1 48,30.66 v48.03,30.62 | U5.1 v48,19.09 v48.01,19.1
  Top 0.813: U$8.3 58.43,57.14 54.46,53.17 C2.1
  Bottom 0.305: v26.26,47.17 v30.23,47.17 | 29.26,27.15 29.36,27.25 30.71,27.25 31.57,28.12 C20.1 | 29.26,27.15 28.42,26.31 | 28.42,26.31 v27.69,25.58 | 28.42,26.31 v30.2,24.54 | v45.14,36.55 45.31,36.55 | 38.24,42.08 v40.26,40.06 | C18.1 24.54,32.84 27.64,29.74 27.64,27.25 29.16,27.25 29.26,27.15
  Bottom 0.406: v7.57,43.81 7.62,43.81 | 7.62,43.81 9.04,43.81 v10.31,45.09 | 7.62,43.81 7.62,37.72 9.5,35.84 v9.5,35.13 9.58,35.05 9.58,31.65 8.31,30.38 v8.31,13.99 | v38.81,42.65 38.24,42.08 36.56,40.4 C19.1 35.18,34.18 33.76,34.18 33.17,33.59 33.17,29.23 32.15,28.21 C20.1 | C12.1 27.58,38.74 27.58,34.79 26.97,34.18 25.6,34.18 24.45,33.02 C18.1 | v45.31,34.41 45.31,36.55 45.31,44.42 v45.44,44.55
  Bottom 0.508: AS1.4 8.51,54.61 9.68,55.78 10.64,55.78 10.67,55.75 v14.92,55.75 17.91,55.75 19.05,54.61 JTAG1.4
  Bottom 0.61: v48.01,19.1 48.01,30.6 v48.03,30.62
+5V  (via drill 0.3, 0.35)
  Top 0.305: C13.1 39.62,78.74 v42.09,76.28 | U$2.18 76.33,38.61 v76.33,38.84 | v64.97,44.45 64.34,43.81 U$3.3
  Top 0.406: R20.2 83.5,81.28 62.23,81.28 5T.TP | 75.67,15.04 ATMEGA328P.18 75.67,22.33 v77.47,24.13 | 75.67,15.04 75.67,14.28 74.85,13.46 ATMEGA328P.6 | ATMEGA328P.4 73.25,14.07 74.22,15.04 75.67,15.04 | v85.09,20.32 R5.2 | v88.9,7.62 87.63,6.35 R7.2 | R3.1 32.96,73.28 32.96,73.29 33.34,73.66 v34.29,73.66
  Top 0.61: U$11.5 v39.64,73.78 v39.65,73.79 | v42.09,76.28 44,76.28 L1.P$1 52.84,76.73 55.9,73.67 | v57.15,67.31 57.17,67.31 U$9.3 | C5.1 57.79,71.68 57.79,71.78 55.9,73.67 | 55.9,73.67 55.9,76.22 59.69,80.01 5T.TP
  Top 0.813: U$9.3 58.7,70.77 C5.1
  Bottom 0.305: v76.33,38.84 76.53,39.04
  Bottom 0.406: v77.47,24.13 81.28,20.32 v85.09,20.32 87.63,17.78 ICP.2 88.9,13.97 v88.9,7.62 | v34.29,73.66 39.52,73.66 v39.65,73.79
  Bottom 0.61: v39.65,73.79 42.09,76.22 v42.09,76.28 | v77.47,24.13 77.47,38.1 76.53,39.04 71.12,44.45 v64.97,44.45 62.23,44.45 57.15,49.53 v57.15,67.31
+12V
  Top 0.813: C10.1 U$9.1 59.34,74.04 61.77,74.04 62.66,74.93 C16.+ 71.86,74.38 L2.P$2 69.19,63.37 62.46,63.37 61.06,61.97 U$8.1 C11.1
ASDO  (via drill 0.35)
  Top 0.305: U2.5 12.22,42.55 | 12.22,42.55 14.57,42.55 v14.73,42.39 | v15.73,43.17 15.87,43.04 IC2.1 | v12.55,43.08 12.55,42.88 12.22,42.55
  Bottom 0.305: v14.73,42.39 15.51,43.17 v15.73,43.17 | AS1.9 10.16,61.2 9.09,60.13 9.09,59.46 7.85,58.22 7.18,58.22 6.3,57.34 6.3,48.95 9.42,45.82 10.54,45.82 12.55,43.81 v12.55,43.08
BLUE_0
  Top 0.305: IC2.52 29.23,19.22 28.55,18.54 24.18,18.54 16.8,11.17 16.8,8.93 DISPLAY.P$21
BLUE_1
  Top 0.305: DISPLAY.P$22 17.26,10.98 24.36,18.09 28.74,18.09 29.73,19.07 IC2.53
BLUE_2
  Top 0.305: DISPLAY.P$23 17.8,8.93 17.8,10.88 24.55,17.63 28.93,17.63 30.73,19.43 IC2.55
BLUE_3
  Top 0.305: DISPLAY.P$24 18.3,8.93 18.3,10.73 24.74,17.17 30.76,17.17 31.73,18.14 IC2.57
BLUE_4
  Top 0.305: DISPLAY.P$25 18.76,10.54 24.93,16.71 30.95,16.71 32.23,18 IC2.58
BLUE_5
  Top 0.305: DISPLAY.P$26 19.26,10.39 25.12,16.26 31.14,16.26 32.77,17.89 32.77,23.5 IC2.59
BLUE_6
  Top 0.305: DISPLAY.P$27 19.76,10.25 25.31,15.8 31.32,15.8 33.23,17.7 IC2.60
BLUE_7
  Top 0.305: DISPLAY.P$28 20.26,10.1 25.5,15.34 31.51,15.34 34.73,18.56 IC2.63
CANH
  Top 0.406: U$3.7 72.25,45.09 D1.1 | D1.1 71.42,46.55 R9.2 | D1.1 77.52,45.4 R1.1 82.81,45.38 TE_AMPSEAL_8.3
CANL
  Top 0.406: U$3.6 72.25,43.81 D1.2 | R8.2 71.19,42.13 D1.2 | D1.2 77.52,43.5 R1.2 82.3,43.48 82.31,43.46 83.73,43.46 83.74,43.48 86.72,43.48 TE_AMPSEAL_8.5
CONF_DONE  (via drill 0.35)
  Top 0.305: AS1.3 R32.1 13.02,52.67 v19.16,46.54 | v40.28,30.58 41.19,30.58 IC2.83
  Bottom 0.305: v19.16,46.54 36.01,46.54 41.02,41.53 41.02,31.29 40.31,30.58 v40.28,30.58
DATA0  (via drill 0.35)
  Top 0.305: v15.62,37.84 15.79,37.67 17.16,37.67 18.29,36.54 IC2.14 | v14.2,37.47 8.59,43.09 8.59,44.11 7.61,45.09 6.35,45.09 U2.2
  Top 0.406: AS1.7 8.74,58.27 8.74,56.69 8.08,56.03 7.38,56.03 6.22,54.88 6.22,48.77 4.83,47.37 4.83,45.54 5.28,45.09 6.35,45.09
  Bottom 0.305: v14.2,37.47 15.24,37.47 v15.62,37.84
DCLK  (via drill 0.35)
  Top 0.305: IC2.15 18.14,36.04 16.97,37.21 15.36,37.21 10.43,42.14 10.43,43.52 10.72,43.81 U2.6 13.3,43.81 v13.33,43.79 | v13.28,45.09 13.28,47.3 10.16,50.42 AS1.1
  Bottom 0.305: v13.33,43.79 13.33,45.04 v13.28,45.09
DISP_CLK
  Top 0.305: DISPLAY.P$30 21.26,10.41 25.74,14.88 31.7,14.88 35.23,18.41 IC2.64
DISP_DEN
  Top 0.305: DISPLAY.P$34 23.26,9.77 26.3,12.82 26.3,12.87 26.48,13.04 32.45,13.04 38.23,18.82 IC2.70
DISP_EN
  Top 0.305: DISPLAY.P$31 21.8,8.93 21.8,10.3 25.93,14.43 31.89,14.43 35.73,18.26 IC2.65
DISP_HSYNC
  Top 0.305: DISPLAY.P$32 22.3,8.93 22.3,10.16 26.12,13.97 32.08,13.97 36.73,18.62 IC2.67
DISP_LEDA  (via drill 0.35)
  Top 0.305: DISPLAY.P$2 7.22,8.93 7.22,14.68 v6.48,15.42
  Top 0.61: v35.59,66.17 35.56,66.14 DISP_A_T.TP
  Top 0.813: C17.1 42.66,69.85 U$14.1 43.35,65.67 U$13.C DISP_A_T.TP
  Bottom 0.61: v6.48,15.42 2.36,19.53 2.36,61.72 8.08,67.44 34.09,67.44 35.36,66.17 v35.59,66.17
DISP_LEDK  (via drill 0.35)
  Top 0.305: v6.35,13.97 6.76,13.56 DISPLAY.P$1
  Top 0.61: U$11.3 37.03,76.2 R19.1 33.97,75.88 v33.02,74.93
  Bottom 0.61: v33.02,74.93 26.67,68.58 7.62,68.58 1.27,62.23 1.27,19.05 v6.35,13.97
DISP_PWM  (via drill 0.35)
  Top 0.305: R3.2 36.63,72.39 | 36.63,72.39 37.13,72.9 37.13,73.77 U$11.4 | 36.63,72.39 v40.64,72.39 | ATMEGA328P.13 76.86,16.92 v76.63,17.14 | v57.2,29.36 49.53,37.03 v49.53,40.64 | v49.55,50.85 49.55,68.56 v46.99,71.12
  Bottom 0.305: v76.63,17.14 72.39,21.38 72.39,24.92 67.94,29.36 v57.2,29.36 | v49.53,40.64 49.53,50.83 v49.55,50.85 | v46.99,71.12 45.72,72.39 v40.64,72.39
DISP_VSYNC
  Top 0.305: DISPLAY.P$33 22.76,9.92 25.85,13.01 25.85,13.06 26.29,13.5 32.26,13.5 37.73,18.97 IC2.69
FPGA_D0_3_3
  Top 0.305: U4.2 48.41,29.84 49.38,30.81 49.38,32.23 46.57,35.04 IC2.92
FPGA_D1_3_3  (via drill 0.35)
  Top 0.305: U4.4 47.85,27.45 47.15,27.45 45.69,28.91 v44.07,28.91 | v43.18,30.67 43.18,32.11 42.75,32.54 IC2.87
  Bottom 0.305: v44.07,28.91 44.07,29.78 v43.18,30.67
FPGA_D2_3_3  (via drill 0.35)
  Top 0.305: IC2.86 42.2,32.04 42.44,31.8 42.44,31.36 v42.55,31.25 | v43.21,28.91 43.44,28.68 43.44,28.65 47.32,24.77 U4.6
  Bottom 0.305: v42.55,31.25 42.55,30.41 43.21,29.75 v43.21,28.91
FPGA_D3_3_3
  Top 0.305: IC2.81 46.33,29.54 47.09,28.77 47.09,28.15 47.33,27.91 48.73,27.91 48.91,27.73 48.91,27.01 52.42,23.5 U4.10
FPGA_DATA0  (via drill 0.35)
  Top 0.406: U4.3 50.52,28.57 v50.72,28.37 | v55.07,27.89 56.51,27.89 62.22,22.18 67.59,22.18 67.84,22.43 71.04,22.43 71.65,21.82 ATMEGA328P.23
  Bottom 0.406: v50.72,28.37 51.2,27.89 v55.07,27.89
FPGA_DATA1  (via drill 0.35)
  Top 0.406: ATMEGA328P.24 70.87,21.82 70.81,21.87 68.08,21.87 67.82,21.62 61.99,21.62 58.04,25.57 v57.46,25.57 v57.45,25.58 | v49.07,25.95 48.99,26.04 U4.5
  Bottom 0.406: v57.45,25.58 49.44,25.58 v49.07,25.95
FPGA_DATA2  (via drill 0.35)
  Top 0.406: U4.7 51.53,23.5 v51.59,23.43 | v57.35,23.5 59.33,23.5 61.76,21.06 66.29,21.06 68.05,19.3 ATMEGA328P.25
  Bottom 0.406: v51.59,23.43 57.28,23.43 v57.35,23.5
FPGA_DATA3
  Top 0.406: ATMEGA328P.26 69.37,18.69 67.87,18.69 66.06,20.5 61.53,20.5 59.85,22.18 53.64,22.18 U4.9
FPGA_R0_3_3
  Top 0.305: IC2.75 42.74,26.54 45.44,23.85 45.44,13.3 47.27,11.46 52.12,11.46 52.81,10.77 52.83,10.79 U5.10
FPGA_R1_3_3
  Top 0.305: U5.6 47.34,12.73 47.27,12.73 45.92,14.09 45.92,24.01 42.89,27.04 IC2.76
FPGA_R2_3_3
  Top 0.305: IC2.79 42.03,28.54 46.38,24.2 46.38,15.45 47.22,14.61 U5.4
FPGA_R3_3_3
  Top 0.305: IC2.80 42.18,29.04 46.84,24.38 46.84,17.78 47.42,17.2 47.95,17.2 U5.2
FPGA_REG0
  Top 0.406: ATMEGA328P.2 71.65,11.3 70.54,10.19 67.51,10.19 66.85,9.53 U5.9
FPGA_REG1  (via drill 0.35)
  Top 0.406: U5.7 51.89,10.79 v51.91,10.77 | v78.21,13.13 77.78,13.56 ATMEGA328P.9
  Bottom 0.406: v51.91,10.77 53.16,9.53 75.82,9.53 78.18,11.89 78.18,13.11 v78.21,13.13
FPGA_REG2  (via drill 0.35)
  Top 0.406: ATMEGA328P.10 v76.89,14.5 | v50.83,13.34 U5.5
  Bottom 0.406: v76.89,14.5 72.54,10.16 54,10.16 v50.83,13.34
FPGA_REG3  (via drill 0.35)
  Top 0.406: U5.3 49.51,15.88 v50.9,14.48 | v76.66,15.36 76.7,15.32 ATMEGA328P.11
  Bottom 0.406: v50.9,14.48 51.51,13.87 51.51,13.44 54.23,10.72 72.31,10.72 76.2,14.61 76.2,14.79 76.66,15.24 v76.66,15.36
FPGA_REG_SEL  (via drill 0.35)
  Top 0.406: U4.11 57.83,24.77 v58.42,24.18 | v61.94,24.22 62.62,23.54 v66.37,23.54 | v66.63,17.7 ATMEGA328P.27
  Bottom 0.406: v58.42,24.18 61.9,24.18 v61.94,24.22 | v66.37,23.54 66.37,17.96 v66.63,17.7
FPGA_RSEL_3_3  (via drill 0.35)
  Top 0.305: IC2.73 42.45,25.54 43.09,24.9 43.09,24.41 43.46,24.04 43.98,24.04 44.01,24.06 v44.33,24.06 | v49.84,30.38 51.36,28.87 51.36,27.13 52.45,26.04 U4.12
  Bottom 0.305: v44.33,24.06 46.91,26.65 46.91,31.1 47.81,32 48.28,32 49.84,30.44 v49.84,30.38
FPGA_W_3_3  (via drill 0.35)
  Top 0.305: IC2.74 42.59,26.04 43.66,24.97 43.66,24.72 v43.72,24.67 | v50.01,31.24 51.41,29.84 U4.15
  Bottom 0.305: v43.72,24.67 46.46,27.41 46.46,31.29 47.62,32.46 48.79,32.46 v50.01,31.24
FPGA_WRITE  (via drill 0.35)
  Top 0.406: ATMEGA328P.1 67.61,12.39 v67.31,12.7 | v67.31,22.86 62.33,22.86 56.59,28.6 56.57,28.57 U4.14
  Bottom 0.406: v67.31,12.7 v67.31,22.86
GND  (via drill 0.3, 0.35)
  Top 0.305: DISPLAY.P$29 20.76,9.86 20.78,9.88 | 24.26,8 DISPLAY.P$36 v24.26,7.7 | DISPLAY.P$29 20.76,7.98 20.73,7.95 | DISPLAY.P$3 7.76,8.01 7.8,7.98 | DISPLAY.P$3 7.76,9.77 7.77,9.78 | U2.4 5.92,42.88 v5.41,42.88 | IC2.110 IC2.111 38.2,44.91 38.2,44.42 38,44.22 35.2,44.22 35.1,44.32 | DISPLAY.P$3 7.76,7.68 v7.75,7.67 | DISPLAY.P$29 20.76,7.75 v20.73,7.72 | IC2.38 IC2.39 22.48,23.79 v22.48,24.71 | IC2.34 IC2.33 19.95,26.82 20.55,26.82 | 20.55,26.82 v20.9,26.82 21.01,26.92 21.01,34.04 20.55,34.04 | IC2.106 41.22,41.68 IC2.105 41.25,41.53 41.83,41.53 42.04,41.33 42.04,38.05 41.25,38.05 IC2.98 41.07,38.02 40.41,38.02 40.41,31.52 | 39.65,28.14 39.65,30.86 40.31,31.52 40.41,31.52 | 39.65,28.14 39.65,28.04 IC2.78 | 41.22,31.52 40.41,31.52 | 41.22,31.52 IC2.85 | 41.22,31.52 41.22,31.06 IC2.84 | 29.72,44.22 28.96,44.22 28.75,44.42 28.75,45.03 IC2.130 | 29.72,44.22 29.72,45.03 IC2.128 | 32.11,44.32 32,44.22 30.48,44.22 | 32.11,44.32 32.23,44.45 IC2.123 | 29.72,44.22 30.48,44.22 | 35.1,44.32 35,44.22 32.21,44.22 32.11,44.32 | 35.1,44.32 35.2,44.42 35.2,45.01 IC2.117 | 33.63,24.36 33.71,24.36 33.71,23.55 IC2.61 | 33.63,24.36 31.45,24.36 31.27,24.18 31.27,23.57 31.24,23.55 IC2.56 | v27.71,24.51 27.71,23.55 IC2.49 | v37.21,24.69 37.21,23.55 IC2.68 | 20.55,26.82 20.55,25.55 19.74,25.55 IC2.36 | 20.55,34.04 IC2.19 | 20.55,34.04 20.55,40.54 IC2.6 | IC2.140 23.75,45.06 23.77,45.09 23.77,48.23 R27.1 | IC2.108 41.25,43.05 42.85,43.05 43.72,43.92 47.98,43.92 U$5.1 | v33.63,24.51 33.63,24.36 | v30.48,34.29 30.48,44.22 | v39.52,28.14 39.65,28.14
  Bottom 0.305: v27.71,24.51 27.51,24.71 v22.48,24.71 | 35.51,26.39 34.57,27.33 C21.2 | 35.51,26.39 36.63,25.27 | 36.63,25.27 v37.21,24.69 | C12.2 29.84,39.01 29.84,39.4 30.12,39.4 30.33,39.6 30.33,41.33 28.27,41.33 26.42,39.47 26.42,35.56 C23.2 | 35.51,26.39 v33.63,24.51 | v39.52,28.14 36.75,25.38 36.73,25.38 36.63,25.27
  other vias: 51.38,20.47 75.97,44.45 72.16,13.97 27.41,32.99 30.43,41.55 24.08,47.9 61.77,75.9
  pour Top (isolate 0.406): 0,83.82 0,0 96.52,0 96.52,83.82
  pour Bottom (isolate 0.406): 0,83.82 0,0 96.52,0 96.52,83.82
GREEN_0
  Top 0.305: DISPLAY.P$13 12.76,12.3 22.66,22.2 23.64,22.2 23.74,22.31 23.74,23.53 IC2.41
GREEN_1
  Top 0.305: IC2.42 24.23,22.15 23.82,21.74 22.85,21.74 13.35,12.24 13.35,12.23 13.3,12.19 13.3,8.93 DISPLAY.P$14
GREEN_2
  Top 0.305: DISPLAY.P$15 13.8,8.93 13.8,12.05 23.04,21.29 24.33,21.29 24.73,21.68 IC2.43
GREEN_3
  Top 0.305: DISPLAY.P$16 14.26,11.86 23.23,20.83 24.64,20.83 25.23,21.42 IC2.44
GREEN_4
  Top 0.305: IC2.45 25.73,20.62 25.48,20.37 23.42,20.37 14.76,11.71 DISPLAY.P$17
GREEN_5
  Top 0.305: DISPLAY.P$18 15.26,11.57 23.61,19.91 25.67,19.91 26.73,20.98 IC2.47
GREEN_6
  Top 0.305: DISPLAY.P$19 15.76,11.42 23.8,19.46 25.86,19.46 27.23,20.83 IC2.48
GREEN_7
  Top 0.305: DISPLAY.P$20 16.3,8.93 16.3,11.31 23.99,19 28.36,19 28.73,19.37 IC2.51
LED1
  Top 0.305: IC2.129 29.23,49.33 FPGA.C
LED2
  Top 0.406: ATMEGA328P.14 90.25,17.7 91.44,16.51 91.44,15.24 92.49,14.19 MICRO.C
MISO  (via drill 0.35)
  Top 0.305: ATMEGA328P.16 78.79,19.3 v78.87,19.23
  Top 0.406: U$2.15 78.74,34.29 80.01,33.02 80.01,20.37 v78.87,19.23
  Bottom 0.305: v78.87,19.23 82.86,15.24 ICP.1
MOSI  (via drill 0.35)
  Top 0.305: ATMEGA328P.15 80.42,18.52 v80.44,18.55
  Top 0.406: v74.17,32.21 74.98,33.02 U$2.14
  Bottom 0.305: v80.44,18.55 82.58,16.41 85.43,16.41 86.33,15.5 86.33,13.99 ICP.4
  Bottom 0.406: v74.17,32.21 74.17,24.82 79.08,19.91 79.15,19.91 79.55,19.51 79.55,19.44 v80.44,18.55
N$1
  Top 0.813: FUSE.P$1 FUSE.P$4 80.85,71.43 L2.P$1
N$2
  Top 0.406: FPGA.A R4.1
N$3
  Top 0.406: R5.1 92.61,16.29 MICRO.A
N$4
  Top 0.406: R6.1 91.98,69.53 3.3V.A
N$5
  Top 0.305: R10.2 68.66,46.61 U$3.8
N$6
  Top 0.406: R8.1 75.5,41.25 C8.1
N$7
  Top 0.406: R9.1 C9.1
N$8
  Top 0.61: U$11.1 42,73.13 L1.P$2
  Top 0.813: L1.P$2 44.45,71.12 45.72,69.85 45.72,69.33 U$14.2
N$12
  Top 0.406: R20.1 93.88,72.71 5V.A
N$21
  Top 0.305: IC2.82 44.78,30.04 R29.1
NCE
  Top 0.305: AS1.6 6.1,55.63 6.1,55.47 5.71,55.09 5.71,48.98 4.32,47.58 4.32,42.88 5.82,41.38 9.65,41.38 13.57,37.45 13.57,37.21 14.02,36.75 16.78,36.75 17.95,35.58 19.69,35.58 IC2.16
  Top 0.406: AS1.6 6.77,58 R30.1
NCONFIG  (via drill 0.35)
  Top 0.305: R31.1 AS1.5 10.16,56.69 9.04,55.58 9.04,54.13 9.8,53.37 10.37,53.37 11.3,52.44 11.3,49.92 13.74,47.48 13.74,45.97 v13.92,45.8 | IC2.20 v18.9,33.54
  Bottom 0.305: v18.9,33.54 16.51,35.93 16.51,38.1 13.97,40.64 13.97,45.74 v13.92,45.8
NCSO  (via drill 0.35)
  Top 0.305: U2.1 6.27,46.35 | 6.27,46.35 6.99,46.35 8.91,44.42 13.59,44.42 15.47,42.54 IC2.2 | v6.25,47.3 6.25,46.38 6.27,46.35
  Bottom 0.305: AS1.8 5.36,57.43 5.36,48.18 v6.25,47.3
PWR_IN_12
  Top 0.813: TE_AMPSEAL_8.8 91.02,58.12 FUSE.P$2 FUSE.P$3
RED_0
  Top 0.305: IC2.25 19.69,31 18.57,31 15.67,28.1 15.67,20.38 8.76,13.47 DISPLAY.P$5
RED_1
  Top 0.305: DISPLAY.P$6 9.26,13.32 16.13,20.19 16.13,27.91 18.71,30.5 19.14,30.5 19.19,30.54 IC2.26
RED_2
  Top 0.305: IC2.27 18.9,30.04 16.59,27.72 16.59,20 9.78,13.2 9.78,8.91 DISPLAY.P$7
RED_3
  Top 0.305: DISPLAY.P$8 10.26,13.03 17.04,19.82 17.04,27.53 19.05,29.54 | 19.05,29.54 | 19.05,29.54 IC2.28
RED_4
  Top 0.305: IC2.30 18.86,28.54 17.5,27.18 17.5,19.63 10.76,12.88 DISPLAY.P$9
RED_5
  Top 0.305: DISPLAY.P$10 11.26,12.74 17.96,19.44 17.96,27 19,28.04 IC2.31
RED_6
  Top 0.305: DISPLAY.P$11 | DISPLAY.P$11 11.76,12.59 18.41,19.25 18.41,26.81 19.15,27.54 IC2.32
RED_7
  Top 0.305: IC2.40 23.23,22.96 22.93,22.66 22.47,22.66 12.3,12.49 12.3,12.46 12.26,12.41 DISPLAY.P$12
RESET  (via drill 0.35)
  Top 0.305: v71.12,16.51 70.81,16.51 70.38,16.08 69.57,16.08 ATMEGA328P.29
  Top 0.406: ICP.5 85.41,9.84 R7.1 | U$2.17 75.18,36.2 74.59,36.2 70.44,32.04 v70.44,24.13
  Bottom 0.305: ICP.5 78.74,16.51 v71.12,16.51
  Bottom 0.406: v70.44,24.13 70.44,23.6 70.39,23.55 70.39,17.09 70.79,16.68 70.94,16.68 v71.12,16.51
RXCAN
  Top 0.305: U$2.2 65.15,36.83 65.02,36.96 65.02,42.27 64.82,42.47 63.75,42.47 U$3.4
SCK  (via drill 0.35)
  Top 0.305: v77.19,20.65 76.48,20.65 ATMEGA328P.17
  Top 0.406: v73.48,31.11 74.22,31.11 74.85,31.75 U$2.13
  Bottom 0.305: ICP.3 83.01,14.78 82.42,14.78 77.19,20.01 v77.19,20.65
  Bottom 0.406: v77.19,20.65 73.48,24.36 v73.48,31.11
TCK  (via drill 0.35)
  Top 0.305: R27.2 JTAG1.1 | IC2.12 19.69,37.58 18.81,37.58 17,39.4 v17,41.91
  Bottom 0.305: v17,41.91 17,43.93 17.02,43.95 17.02,45.94 18.71,47.62 20.69,47.62 22.77,49.71 22.77,51.98 JTAG1.1
TDI  (via drill 0.35)
  Top 0.305: R28.2 JTAG1.9 | IC2.13 19.69,37.08 18.67,37.08 16.37,39.38 v16.37,41.33
  Bottom 0.305: v16.37,41.33 16.37,42.17 16.54,42.34 16.54,44.12 16.56,44.14 16.56,46.13 18.52,48.08 20.5,48.08 21.59,49.17 | 21.59,49.17 | 21.59,49.17 21.59,60.96 JTAG1.9
TDO  (via drill 0.35)
  Top 0.305: IC2.10 19.68,38.59 19.1,38.59 18.26,39.43 v18.26,41.91
  Bottom 0.305: v18.26,41.91 18.26,43.93 17.48,44.72 17.48,45.75 18.89,47.17 20.88,47.17 23.23,49.52 23.23,50.28 24.11,51.16 24.11,53.31 24.13,53.34 JTAG1.3
TMS  (via drill 0.35)
  Top 0.305: R33.1 JTAG1.5 21.59,55.88 21.59,47.63 v17.63,43.67 | v17.63,41.33 17.8,41.15 17.8,39.24 18.96,38.08 19.69,38.08 IC2.11
  Bottom 0.305: v17.63,43.67 v17.63,41.33
TXCAN
  Top 0.305: U$2.1 66.42,45.03 65.1,46.35 U$3.1
VCC  (via drill 0.35)
  Top 0.305: v43.26,42.54 IC2.107 39.62,42.54 36.58,39.5 v36.58,33.86 | v39.8,45.06 39.78,45.04 IC2.109 39.23,44.31 v38.1,43.18 | IC2.124 31.73,45.06 31.7,45.09 31.7,47.73 30.35,49.07 30.35,50.24 30.15,50.44 28.27,50.44 28.27,45.19 IC2.131 28.22,36.85 v28.27,36.73 26.36,36.73 v25.2,35.56 25.2,26.19 | 21.06,24.21 20.22,25.04 18.92,25.04 18.92,25.83 19.13,26.04 19.71,26.04 IC2.35 | 21.06,24.21 21.72,23.55 IC2.37 | 29.23,25.15 28.27,24.18 28.27,23.57 28.25,23.55 IC2.50 | 29.23,25.15 34.24,25.15 IC2.62 | 21.06,24.21 23.04,26.19 25.2,26.19 | 25.2,26.19 29.16,26.19 29.16,25.27 29.23,25.15
  Top 0.508: v43.26,42.54 48.89,42.54 1.2T.TP 51.74,45.39 U$5.2
  Bottom 0.305: v39.8,45.06 40.74,45.06 v43.26,42.54 | v38.1,43.18 35.29,40.37 C1.1 30.32,38.94 30.32,37.59 30.14,37.41 28.8,37.41 28.27,36.89 v28.27,36.73 28.27,31.15 28.11,30.99 28.11,29.32 C22.1 | v36.58,33.86 36.58,33.04 C21.1 | v25.2,35.56 C23.1
XTAL1
  Top 0.305: C3.2 70.25,6.22 U$4.3 75.67,9.16 ATMEGA328P.7
XTAL2
  Top 0.305: C4.1 77.53,8.62 U$4.1 77.13,10.86 76.48,11.51 76.48,12.37 ATMEGA328P.8
~CS_CAN  (via drill 0.35)
  Top 0.305: ATMEGA328P.28 70.58,16.92 70.63,16.97 70.67,16.97 v71.07,17.37 | v71.07,23.27 71.07,31.95 74.75,35.64 74.83,35.56 U$2.16
  Bottom 0.305: v71.07,17.37 v71.07,23.27
~INT_CAN  (via drill 0.35)
  Top 0.305: ATMEGA328P.32 70.64,13.72 71.93,15.01 v71.93,17.14 | v71.7,23.85 71.53,24.02 71.53,29.87 72.14,30.48 U$2.12
  Bottom 0.305: v71.93,17.14 71.93,23.62 v71.7,23.85

### Text on the board
tNames: IFE 2018 / DISPLAY